# EAGLE design печатная плата (EAGLE 9.6.2)
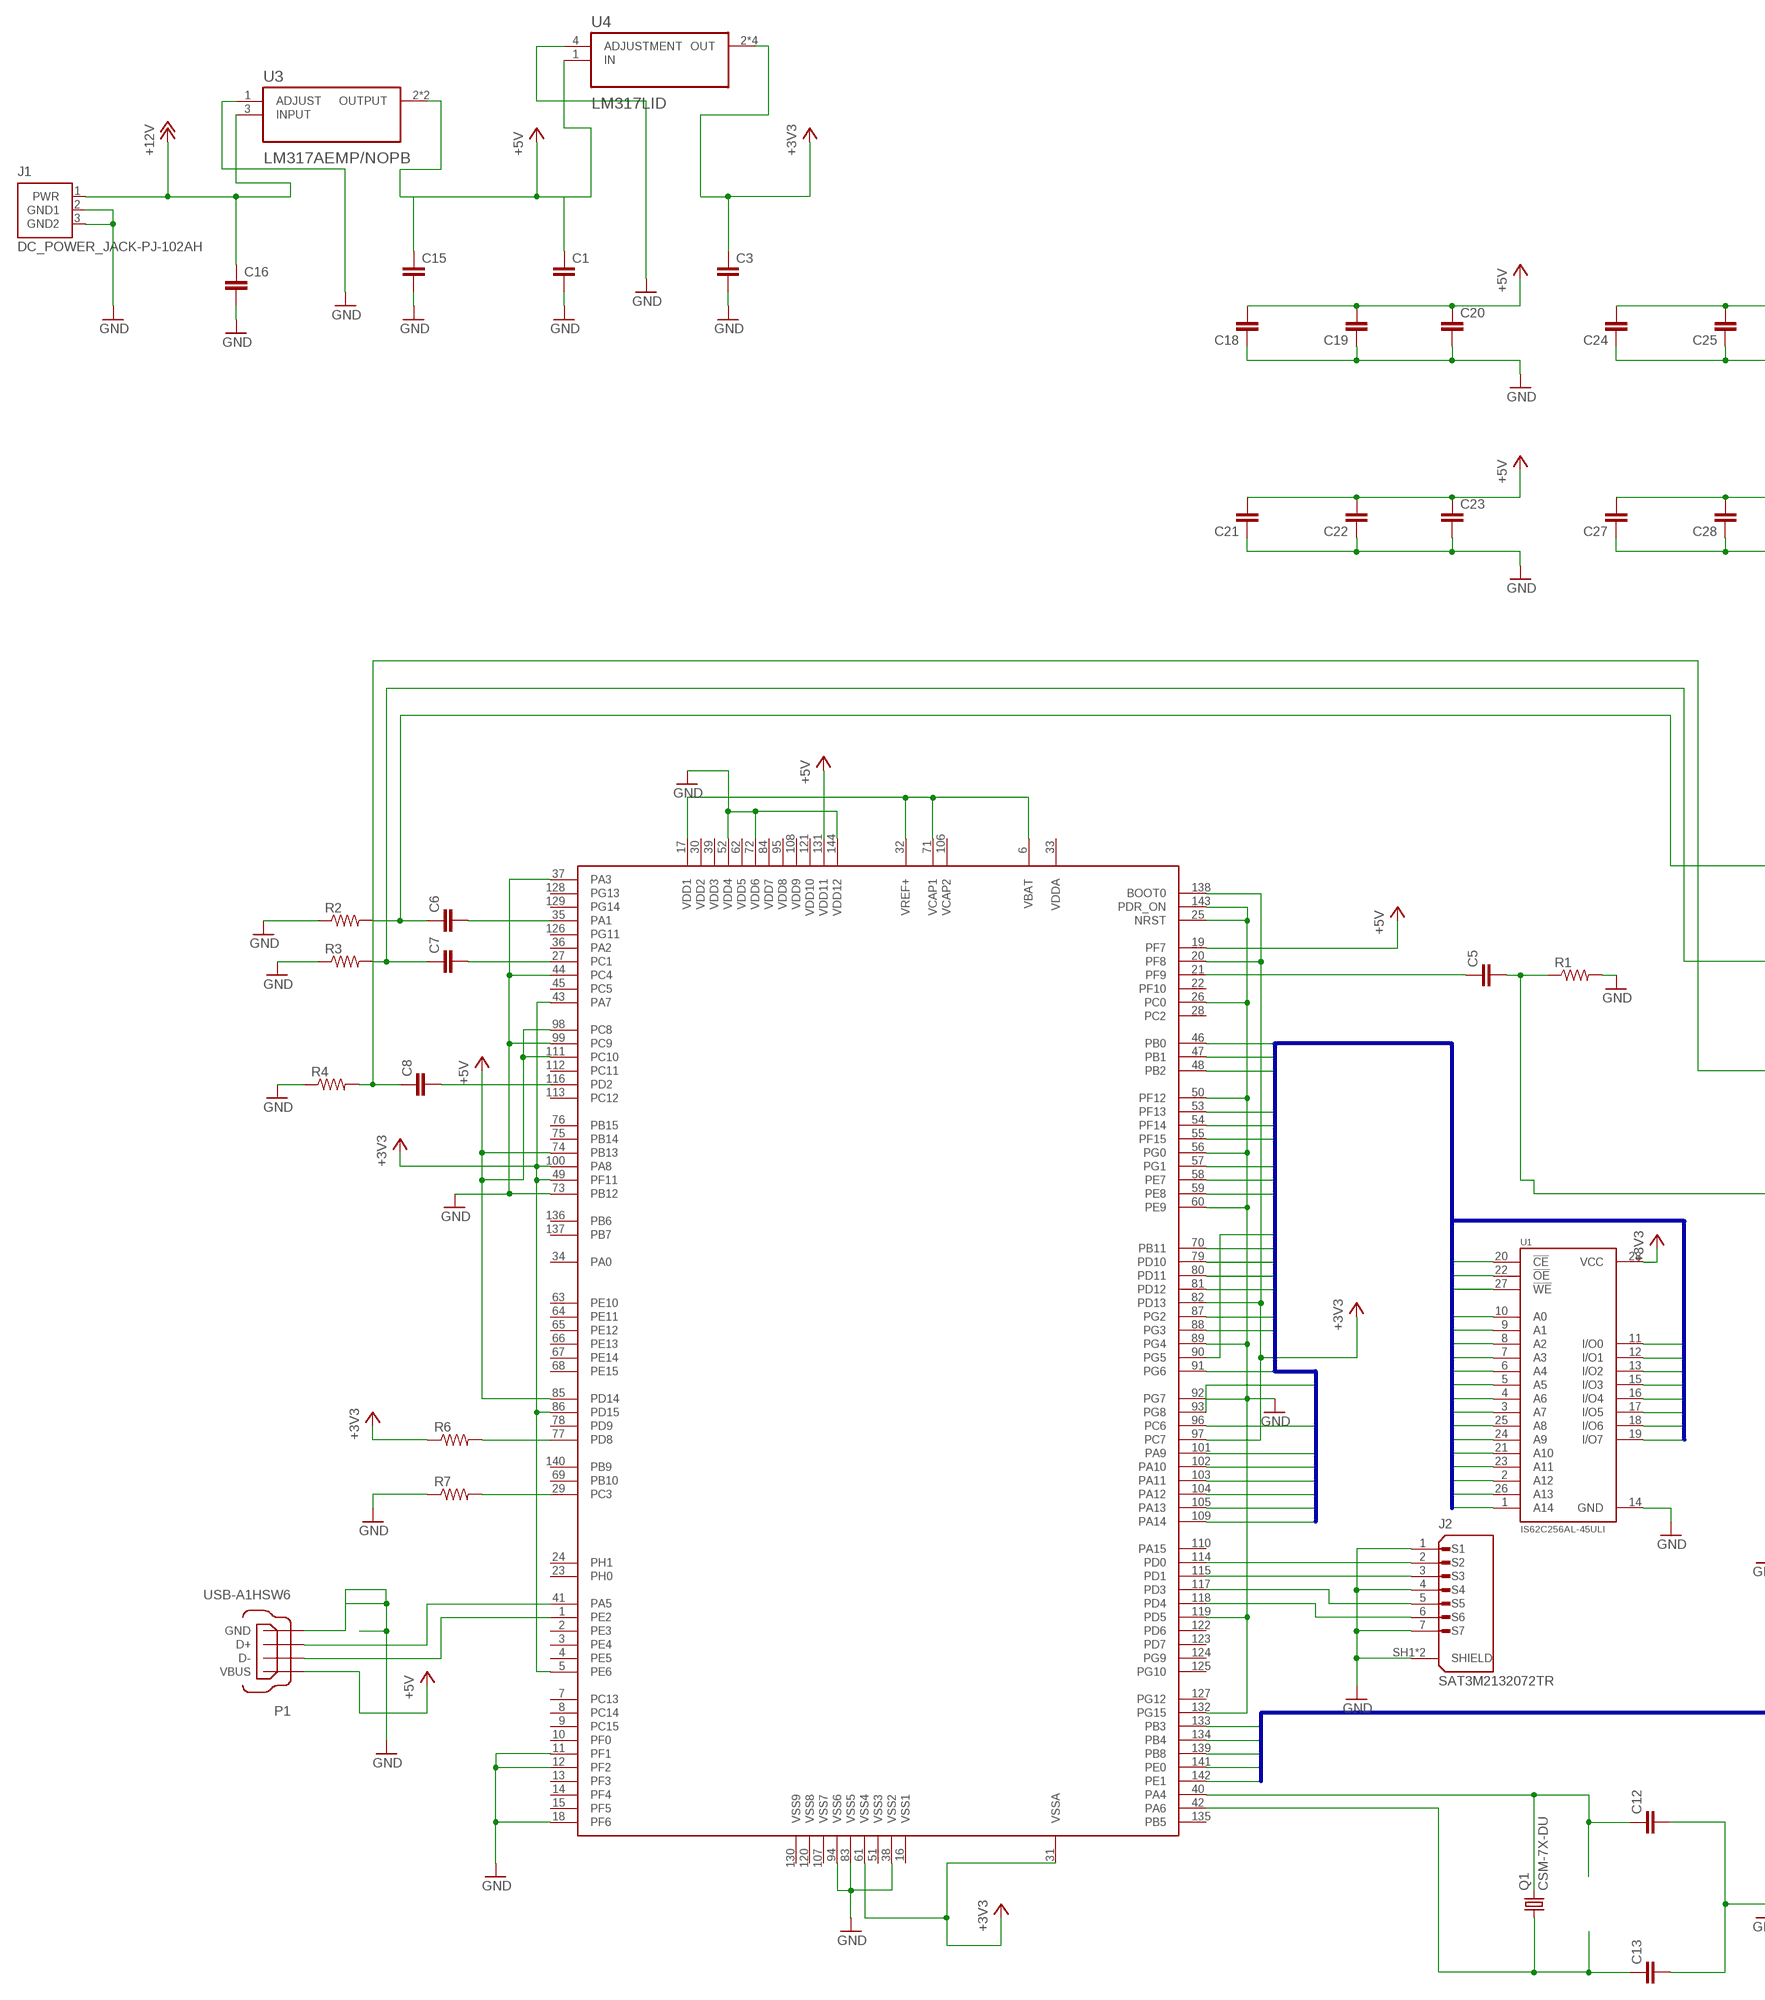
[diagram p0: schematic, sheet 1, part 1 of 2]
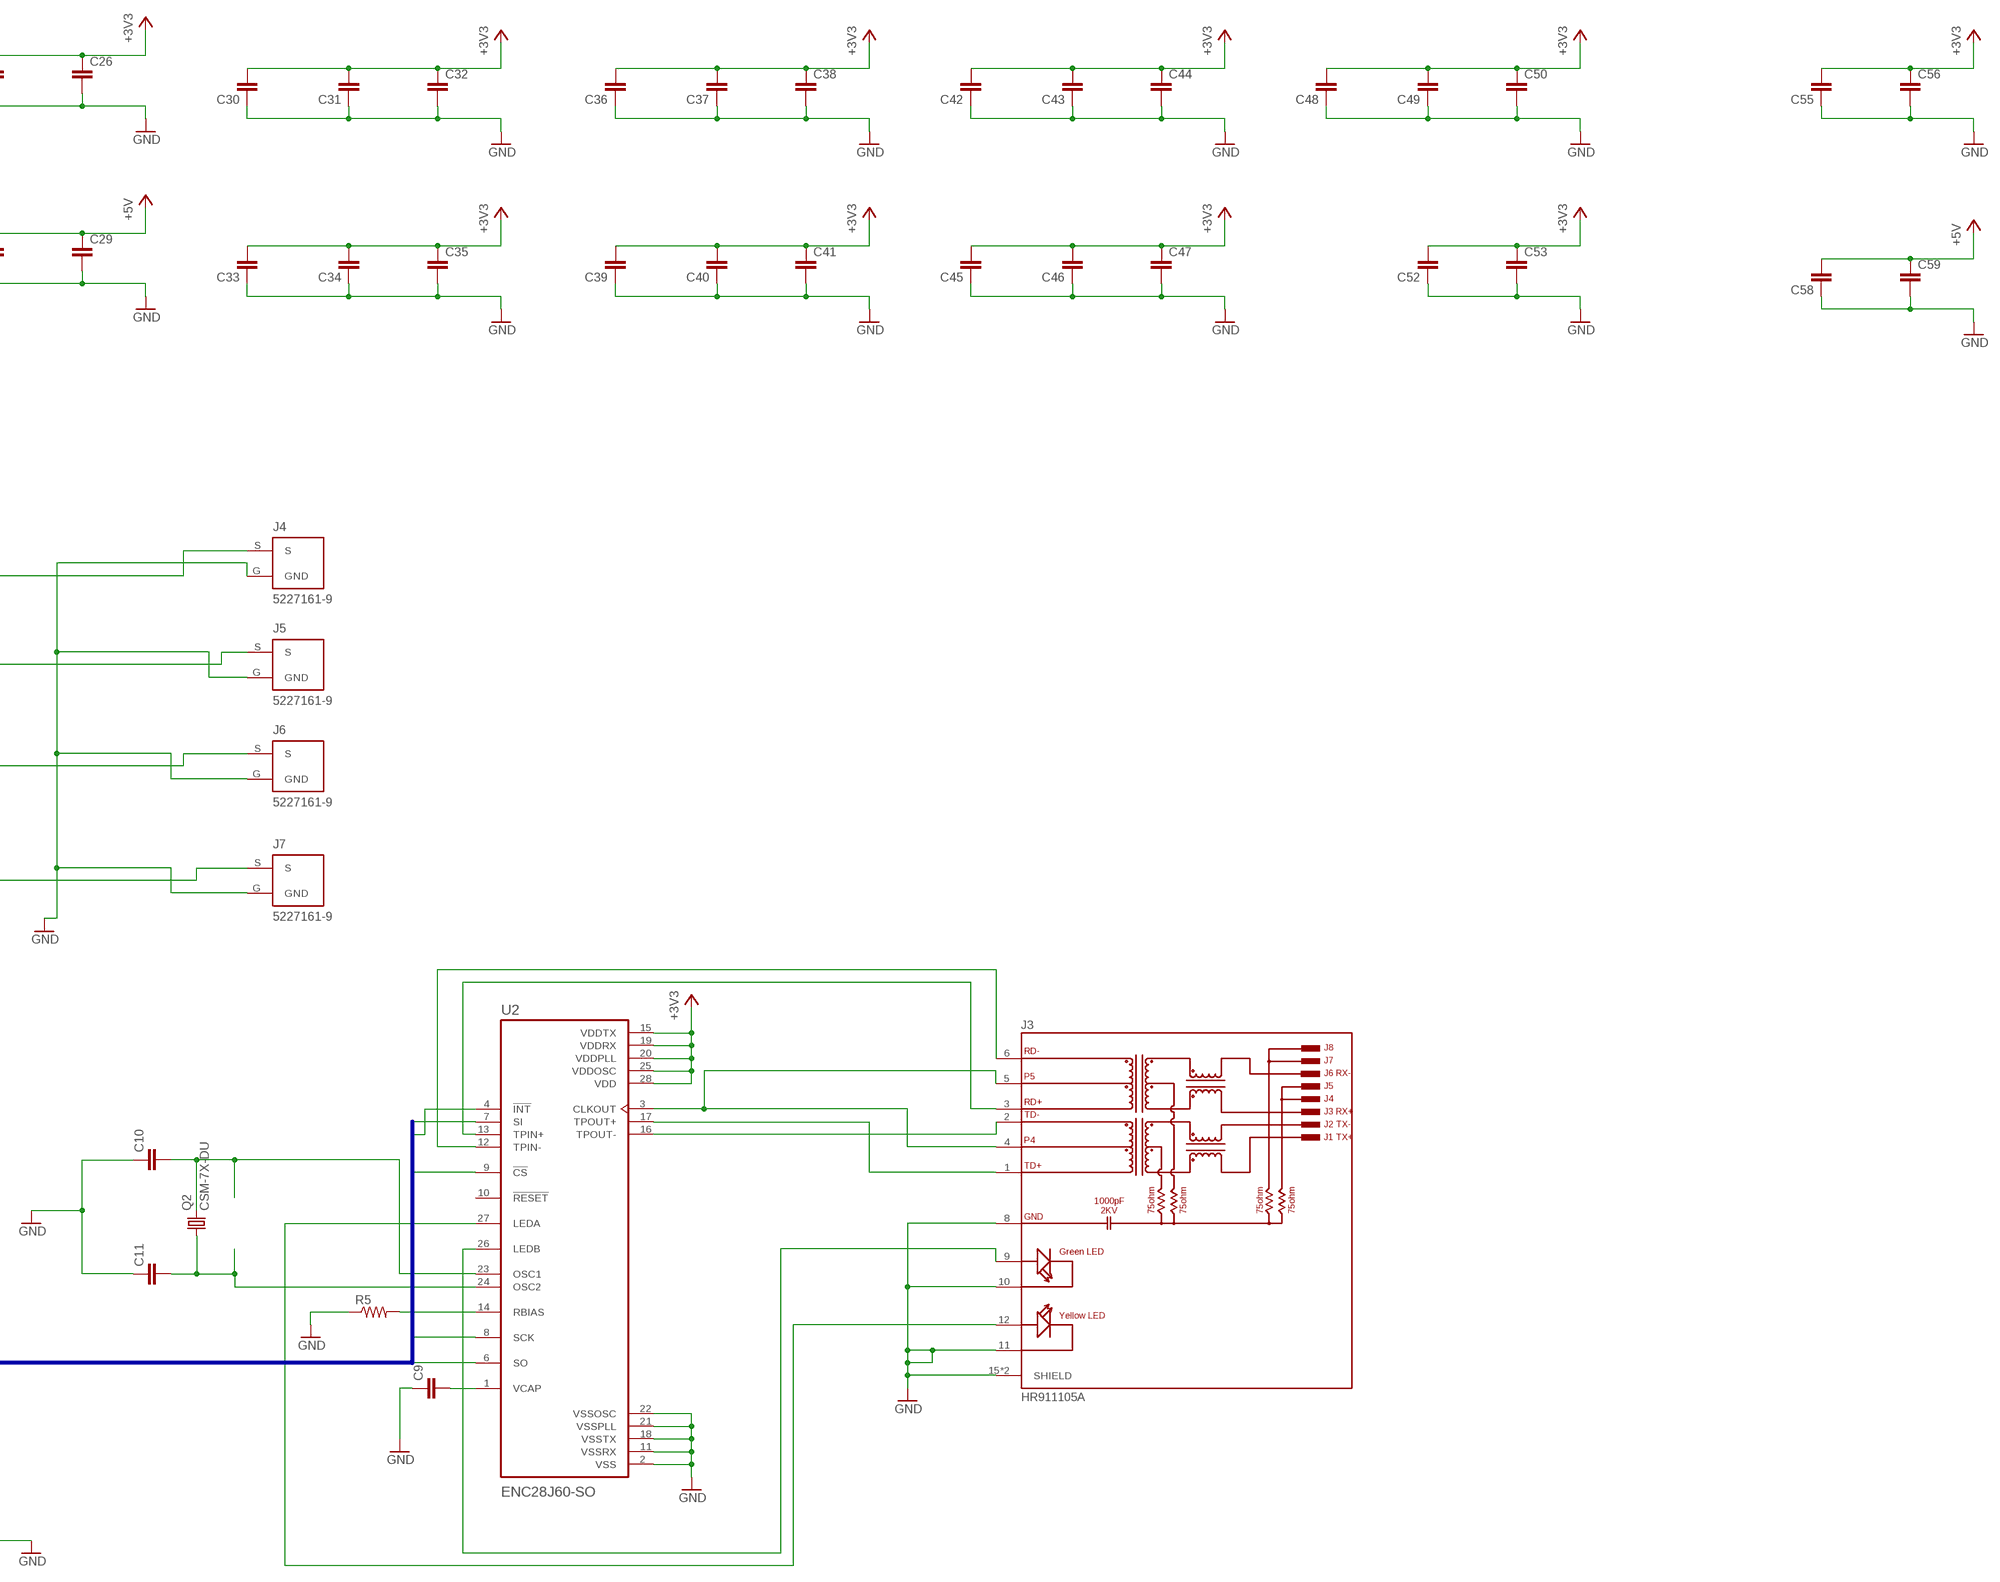
[diagram p1: schematic, sheet 1, part 2 of 2]

## Parts
C1  C_0201  [0201]
C3  C_0201  [0201]
C5  C_0201  [0201]
C6  C_0201  [0201]
C7  C_0201  [0201]
C8  C_0201  [0201]
C9  C_0201  [0201]
C10  C_0201  [0201]
C11  C_0201  [0201]
C12  C_0201  [0201]
C13  C_0201  [0201]
C15  C_0201  [0201]
C16  C_0201  [0201]
C18  C_0201  [0201]
C19  C_0201  [0201]
C20  C_0201  [0201]
C21  C_0201  [0201]
C22  C_0201  [0201]
C23  C_0201  [0201]
C24  C_0201  [0201]
C25  C_0201  [0201]
C26  C_0201  [0201]
C27  C_0201  [0201]
C28  C_0201  [0201]
C29  C_0201  [0201]
C30  C_0201  [0201]
C31  C_0201  [0201]
C32  C_0201  [0201]
C33  C_0201  [0201]
C34  C_0201  [0201]
C35  C_0201  [0201]
C36  C_0201  [0201]
C37  C_0201  [0201]
C38  C_0201  [0201]
C39  C_0201  [0201]
C40  C_0201  [0201]
C41  C_0201  [0201]
C42  C_0201  [0201]
C43  C_0201  [0201]
C44  C_0201  [0201]
C45  C_0201  [0201]
C46  C_0201  [0201]
C47  C_0201  [0201]
C48  C_0201  [0201]
C49  C_0201  [0201]
C50  C_0201  [0201]
C52  C_0201  [0201]
C53  C_0201  [0201]
C55  C_0201  [0201]
C56  C_0201  [0201]
C58  C_0201  [0201]
C59  C_0201  [0201]
J1  DC_POWER_JACK-PJ-102AH  [PJ-102AH]
J2  SAT3M2132072TR  [AMPHENOL_SAT3M2132072TR]
J3  HR911105A  [HANRUN_HR911105A]
J4  5227161-9  [TE_5227161-9]
J5  5227161-9  [TE_5227161-9]
J6  5227161-9  [TE_5227161-9]
J7  5227161-9  [TE_5227161-9]
P1  USB-A1HSW6  [OST_USB-A1HSW6]
Q1  CSM-7X-DU  [CSM-7X-DU]
Q2  CSM-7X-DU  [CSM-7X-DU]
R1  R-US_M1406  [M1406]
R2  R-US_M1406  [M1406]
R3  R-US_M1406  [M1406]
R4  R-US_M1406  [M1406]
R5  R-US_M1406  [M1406]
R6  R-US_M1406  [M1406]
R7  R-US_M1406  [M1406]
U1  IS62C256AL-45ULI  [SOIC127P1210X305-28N]
U2  ENC28J60-SO  [SOIC127P1030X265-28N]
U3  LM317AEMP/NOPB  [SOT230P700X180-4N]
U4  LM317LID  [SOIC127P599X175-8N]
U$1  STM32F4Z_144PIN  [LQFP144]

## Nets
+3V3 [supply]: C3.1 C24.2 C25.2 C26.1 C30.2 C31.2 C32.1 C33.2 C34.2 C35.1 C36.2 C37.2 C38.1 C39.2 C40.2 C41.1 C42.2 C43.2 C44.1 C45.2 C46.2 C47.1 C48.2 C49.2 C50.1 C52.2 C53.1 C55.2 C56.1 R6.1 U1.28(VCC) U2.15(VDDTX) U2.19(VDDRX) U2.20(VDDPLL) U2.25(VDDOSC) U2.28(VDD) U4.2(OUT) U4.3(OUT) U4.6(OUT) U4.7(OUT) U$1.5(PE6) U$1.20(PF8) U$1.31(VSSA) U$1.43(PA7) U$1.49(PF11) U$1.61(VSS4) U$1.82(PD13) U$1.86(PD15) U$1.97(PC7) U$1.100(PA8) U$1.138(BOOT0)
+5V [supply]: C1.1 C18.2 C19.2 C20.1 C21.2 C22.2 C23.1 C27.2 C28.2 C29.1 C58.2 C59.1 P1.1(VBUS) U3.2(OUTPUT) U3.4(OUTPUT) U4.1(IN) U$1.19(PF7) U$1.74(PB13) U$1.85(PD14) U$1.98(PC8) U$1.111(PC10) U$1.131(VDD11)
+5V1: C15.1
+12V [supply]: C16.1 J1.1(PWR) U3.3(INPUT)
A1: U2.6(SO) U$1.133(PB3)
A2: U2.8(SCK) U$1.134(PB4)
A3: U2.9(!CS) U$1.139(PB8)
A4: U2.7(SI) U$1.141(PE0)
A5: U2.4(!INT) U$1.142(PE1)
D0: U$1.46(PB0)
D1: U1.20(!CE)
D2: U1.22(!OE) U$1.47(PB1) U$1.48(PB2)
D3: U1.27(!WE) U$1.53(PF13)
D4: U1.10(A0) U$1.54(PF14)
D5: U1.9(A1) U$1.55(PF15)
D6: U1.8(A2) U$1.57(PG1)
D7: U1.7(A3) U$1.58(PE7)
D8: U1.6(A4) U$1.59(PE8)
D9: U1.5(A5) U$1.70(PB11)
D10: U1.4(A6) U$1.79(PD10)
D11: U1.3(A7) U$1.80(PD11)
D12: U1.25(A8) U$1.81(PD12)
D13: U1.24(A9) U$1.87(PG2)
D14: U1.21(A10) U$1.88(PG3)
D15: U1.23(A11)
D16: U1.2(A12) U$1.91(PG6)
D17: U1.26(A13) U$1.93(PG8)
D18: U1.1(A14) U$1.96(PC6)
D19: U1.11(I/O0) U$1.101(PA9)
D20: U1.12(I/O1)
D21: U1.13(I/O2) U$1.102(PA10)
D22: U1.15(I/O3) U$1.103(PA11)
D23: U1.16(I/O4) U$1.104(PA12)
D24: U1.17(I/O5) U$1.105(PA13)
D25: U1.18(I/O6) U$1.109(PA14)
D26: U1.19(I/O7) U$1.90(PG5)
GND [supply]: C1.2 C3.2 C9.1 C10.1 C11.1 C12.2 C13.2 C15.2 C16.2 C18.1 C19.1 C20.2 C21.1 C22.1 C23.2 C24.1 C25.1 C26.2 C27.1 C28.1 C29.2 C30.1 C31.1 C32.2 C33.1 C34.1 C35.2 C36.1 C37.1 C38.2 C39.1 C40.1 C41.2 C42.1 C43.1 C44.2 C45.1 C46.1 C47.2 C48.1 C49.1 C50.2 C52.1 C53.2 C55.1 C56.2 C58.1 C59.2 J1.2(GND1) J1.3(GND2) J2.1(S1) J2.4(S4) J2.7(S7) J2.SH1(SHIELD) J2.SH2(SHIELD) J3.8(GND) J3.10(GC) J3.11(YC) J3.15(SHIELD) J3.16(SHIELD) J4.G(GND) J5.G(GND) J6.G(GND) J7.G(GND) P1.4(GND) R1.2 R2.1 R3.1 R4.1 R5.1 R7.1 U1.14(GND) U2.2(VSS) U2.11(VSSRX) U2.18(VSSTX) U2.21(VSSPLL) U2.22(VSSOSC) U3.1(ADJUST) U4.4(ADJUSTMENT) U$1.11(PF1) U$1.12(PF2) U$1.18(PF6) U$1.25(NRST) U$1.26(PC0) U$1.37(PA3) U$1.38(VSS2) U$1.44(PC4) U$1.50(PF12) U$1.52(VDD4) U$1.56(PG0) U$1.60(PE9) U$1.72(VDD6) U$1.73(PB12) U$1.83(VSS5) U$1.89(PG4) U$1.92(PG7) U$1.94(VSS6) U$1.99(PC9) U$1.119(PD5) U$1.132(PG15) U$1.143(PDR_ON) U$1.144(VDD12)
N$1: C5.2 J7.S R1.1
N$2: U$1.6(VBAT) U$1.17(VDD1) U$1.32(VREF+) U$1.71(VCAP1)
N$3: C6.1 J4.S R2.2
N$4: C7.1 J5.S R3.2
N$5: C8.1 J6.S R4.2
N$6: J2.2(S2) U$1.114(PD0)
N$7: C6.2 U$1.35(PA1)
N$8: C7.2 U$1.27(PC1)
N$9: C8.2 U$1.116(PD2)
N$10: C5.1 U$1.21(PF9)
N$11: J2.3(S3) U$1.115(PD1)
N$12: J2.5(S5) U$1.117(PD3)
N$13: J2.6(S6) U$1.118(PD4)
N$14: J3.2(TD-) U2.16(TPOUT-)
N$15: J3.1(TD+) U2.17(TPOUT+)
N$16: J3.3(RD+) U2.13(TPIN+)
N$17: J3.6(RD-) U2.12(TPIN-)
N$18: C9.2 U2.1(VCAP)
N$19: C12.1 Q1.2 U$1.40(PA4)
N$20: C11.2 Q2.1 U2.24(OSC2)
N$21: C10.2 Q2.2 U2.23(OSC1)
N$22: C13.1 Q1.1 U$1.42(PA6)
N$23: R5.2 U2.14(RBIAS)
N$24: R7.2 U$1.29(PC3)
N$25: J3.4 J3.5 U2.3(CLKOUT)
N$26: R6.2 U$1.77(PD8)
N$27: P1.3(D+) U$1.41(PA5)
N$28: P1.2(D-) U$1.1(PE2)
N$29: J3.9(GA) U2.26(LEDB)
N$30: J3.12(YA) U2.27(LEDA)
Unconnected: U2.10(!RESET) U$1.2(PE3) U$1.3(PE4) U$1.4(PE5) U$1.7(PC13) U$1.8(PC14) U$1.9(PC15) U$1.10(PF0) U$1.13(PF3) U$1.14(PF4) U$1.15(PF5) U$1.16(VSS1) U$1.22(PF10) U$1.23(PH0) U$1.24(PH1) U$1.28(PC2) U$1.30(VDD2) U$1.33(VDDA) U$1.34(PA0) U$1.36(PA2) U$1.39(VDD3) U$1.45(PC5) U$1.51(VSS3) U$1.62(VDD5) U$1.63(PE10) U$1.64(PE11) U$1.65(PE12) U$1.66(PE13) U$1.67(PE14) U$1.68(PE15) U$1.69(PB10) U$1.75(PB14) U$1.76(PB15) U$1.78(PD9) U$1.84(VDD7) U$1.95(VDD8) U$1.106(VCAP2) U$1.107(VSS7) U$1.108(VDD9) U$1.110(PA15) U$1.112(PC11) U$1.113(PC12) U$1.120(VSS8) U$1.121(VDD10) U$1.122(PD6) U$1.123(PD7) U$1.124(PG9) U$1.125(PG10) U$1.126(PG11) U$1.127(PG12) U$1.128(PG13) U$1.129(PG14) U$1.130(VSS9) U$1.135(PB5) U$1.136(PB6) U$1.137(PB7) U$1.140(PB9)

## Buses
D[0..26]
A[0..6]

## Library data of the parts
C1 C3 C5-C13 C15 C16 C18-C50 C52 C53 C55 C56 C58 C59 = RHD2000_eval_board:C: Capacitor
J1 = connectors:DC_POWER_JACK: DC Power Jack
J2 = SAT3M2132072TR:SAT3M2132072TR: Check availability <https://pricing.snapeda.com/parts/SAT3M2132072TR/AMPHENOL%20ICC%20/%20FCI/view-part?ref=eda>; AVAILABILITY: In Stock; DESCRIPTION: Sata,Storage and server connector,1.27mm pitch,Right angle,surface mount,1.5A current,Tape and Reel.; MF: AMPHENOL ICC / FCI; MP: SAT3M2132072TR; PACKAGE: None; PRICE: None; PURCHASE-URL: https://pricing.snapeda.com/search/part/SAT3M2132072TR/?ref=eda
J3 = HR911105A:HR911105A: DIP RJ45 Connector; Check availability <https://pricing.snapeda.com/parts/HR911105A/hanrun/view-part?ref=eda>; AVAILABILITY: Not in stock; MF: hanrun; MP: HR911105A; PACKAGE: None; PRICE: None
J4-J7 = 5227161-9:5227161-9: Jack, PCB; 50 Ohms; Right Angle; BNC; Gold (30); Panel; Jack; Valox; Phosphor Bronze Check availability <https://pricing.snapeda.com/parts/5227161-9/TE%20Connectivity/view-part?ref=eda>; AVAILABILITY: In Stock; COMMENT: 5227161-9; DESCRIPTION: RTANG JACK W/MTG PINS,BNC PCB; EU_ROHS_COMPLIANCE: Compliant with Exemptions; MF: TE Connectivity; MP: 5227161-9; NUMBER_OF_POSITIONS: 1; PACKAGE: None; PRICE: None; PURCHASE-URL: https://pricing.snapeda.com/search/part/5227161-9/?ref=eda
P1 = USB-A1HSW6:USB-A1HSW6: USB - A Receptacle Connector 4 Position Through Hole, Right Angle Check availability <https://pricing.snapeda.com/parts/USB-A1HSW6/On%20Shore/view-part?ref=eda>; AVAILABILITY: In Stock; DESCRIPTION: USB-A (USB TYPE-A) - Receptacle Connector 4 Position Through Hole, Right Angle; MF: On Shore; MP: USB-A1HSW6; PACKAGE: None; PRICE: None; PURCHASE-URL: https://pricing.snapeda.com/search/part/USB-A1HSW6/?ref=eda
Q1 Q2 = crystal:CSM-7X-DU: SMD CRYSTAL Source: www.ecsxtal.com .. Crystal 3.6864MHz CSM_7X_DU.PDF; OC_FARNELL: unknown; OC_NEWARK: unknown
R1-R7 = adafruit:R-US_: RESISTOR, American symbol
U1 = IS62C256AL-45ULI:IS62C256AL-45ULI: SRAM Chip Asynchronous Single 5 Volt 256k-Bit 32k X 8 45ns 28-Pin Sop Check availability <https://pricing.snapeda.com/parts/IS62C256AL-45ULI/ISSI/view-part?ref=eda>; AVAILABILITY: In Stock; DESCRIPTION: SRAM - Asynchronous Memory IC 256Kb (32K x 8) Parallel 45 ns 28-SOP; MF: ISSI; MP: IS62C256AL-45ULI; PACKAGE: SOP-28 ISSI; PRICE: None; PURCHASE-URL: https://pricing.snapeda.com/search/part/IS62C256AL-45ULI/?ref=eda
U2 = ENC28J60:ENC28J60: Check availability <https://pricing.snapeda.com/parts/ENC28J60/Microchip/view-part?ref=eda>; AVAILABILITY: In Stock; DESCRIPTION: Ethernet Controller 10 Base-T PHY SPI Interface 28-QFN (6x6); MF: Microchip; MP: ENC28J60; PACKAGE: SSOP Microchip; PRICE: None; PURCHASE-URL: https://pricing.snapeda.com/search/part/ENC28J60/?ref=eda
U3 = LM317AEMP_NOPB:LM317AEMP/NOPB: Check availability <https://pricing.snapeda.com/parts/LM317AEMP/Texas%20Instruments/view-part?ref=eda>; AVAILABILITY: In Stock; DESCRIPTION: 1.5-A, 40-V, adjustable linear voltage regulator with high-accuracy 4-SOT-223 -40 to 125; MF: Texas Instruments; MP: LM317AEMP; PACKAGE: SOT-223-4 Texas Instruments; PRICE: None; PURCHASE-URL: https://pricing.snapeda.com/search/part/LM317AEMP/?ref=eda
U4 = LM317LID:LM317LID: Check availability <https://pricing.snapeda.com/parts/LM317LID/Texas%20Instruments/view-part?ref=eda>; AVAILABILITY: In Stock; DESCRIPTION: 100-mA, 35-V, adjustable linear voltage regulator; MF: Texas Instruments; MP: LM317LID; PACKAGE: SOIC-8 Texas Instruments; PRICE: None; PURCHASE-URL: https://pricing.snapeda.com/search/part/LM317LID/?ref=eda
U$1 = stm32f4:STM32F4Z_144PIN: STM32F4XX LQFP packages with actual and functional symbols.

## Net classes
0 default: width 0.152 mm
1 supply: width 0.406 mm

## Board
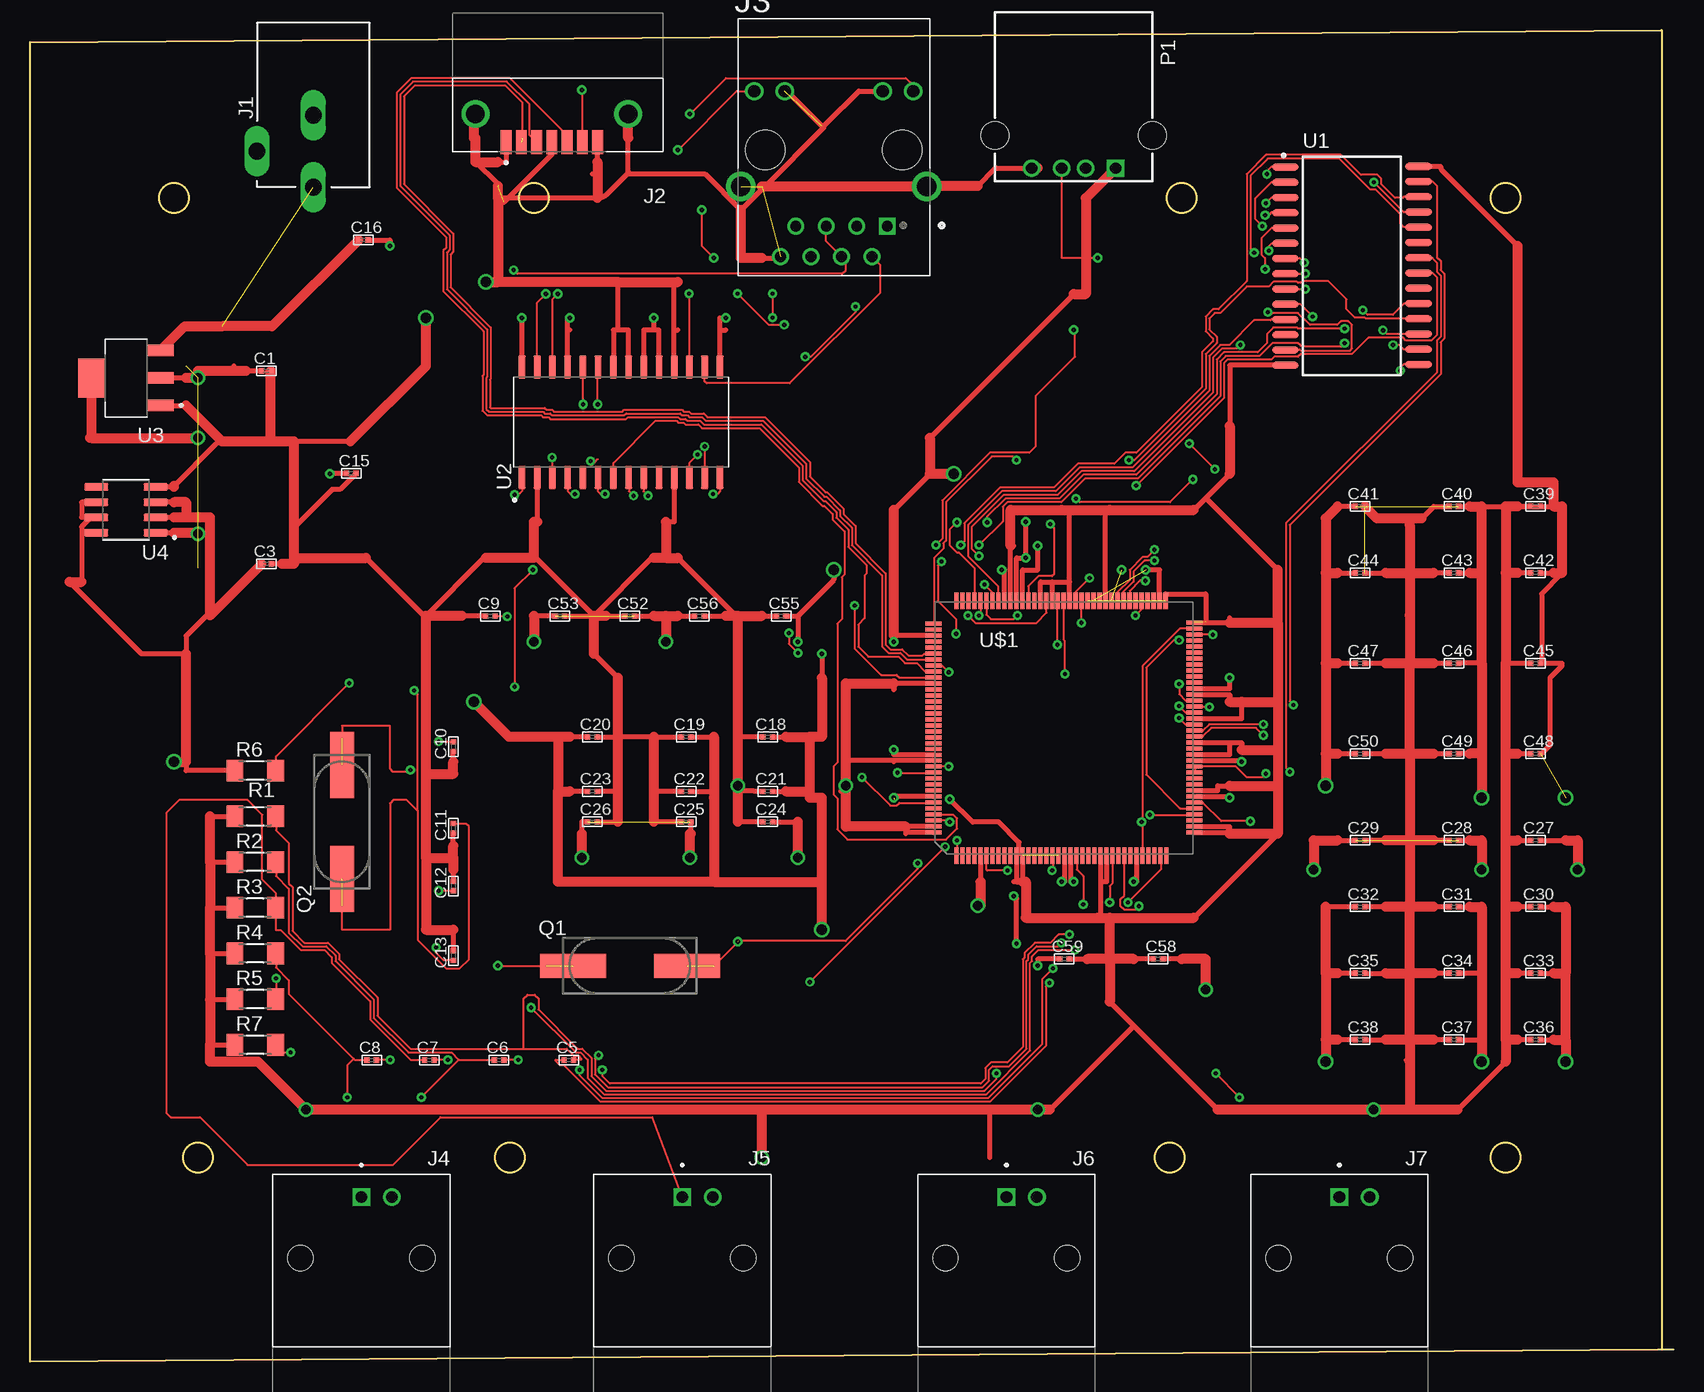
[diagram p2: board, top side]
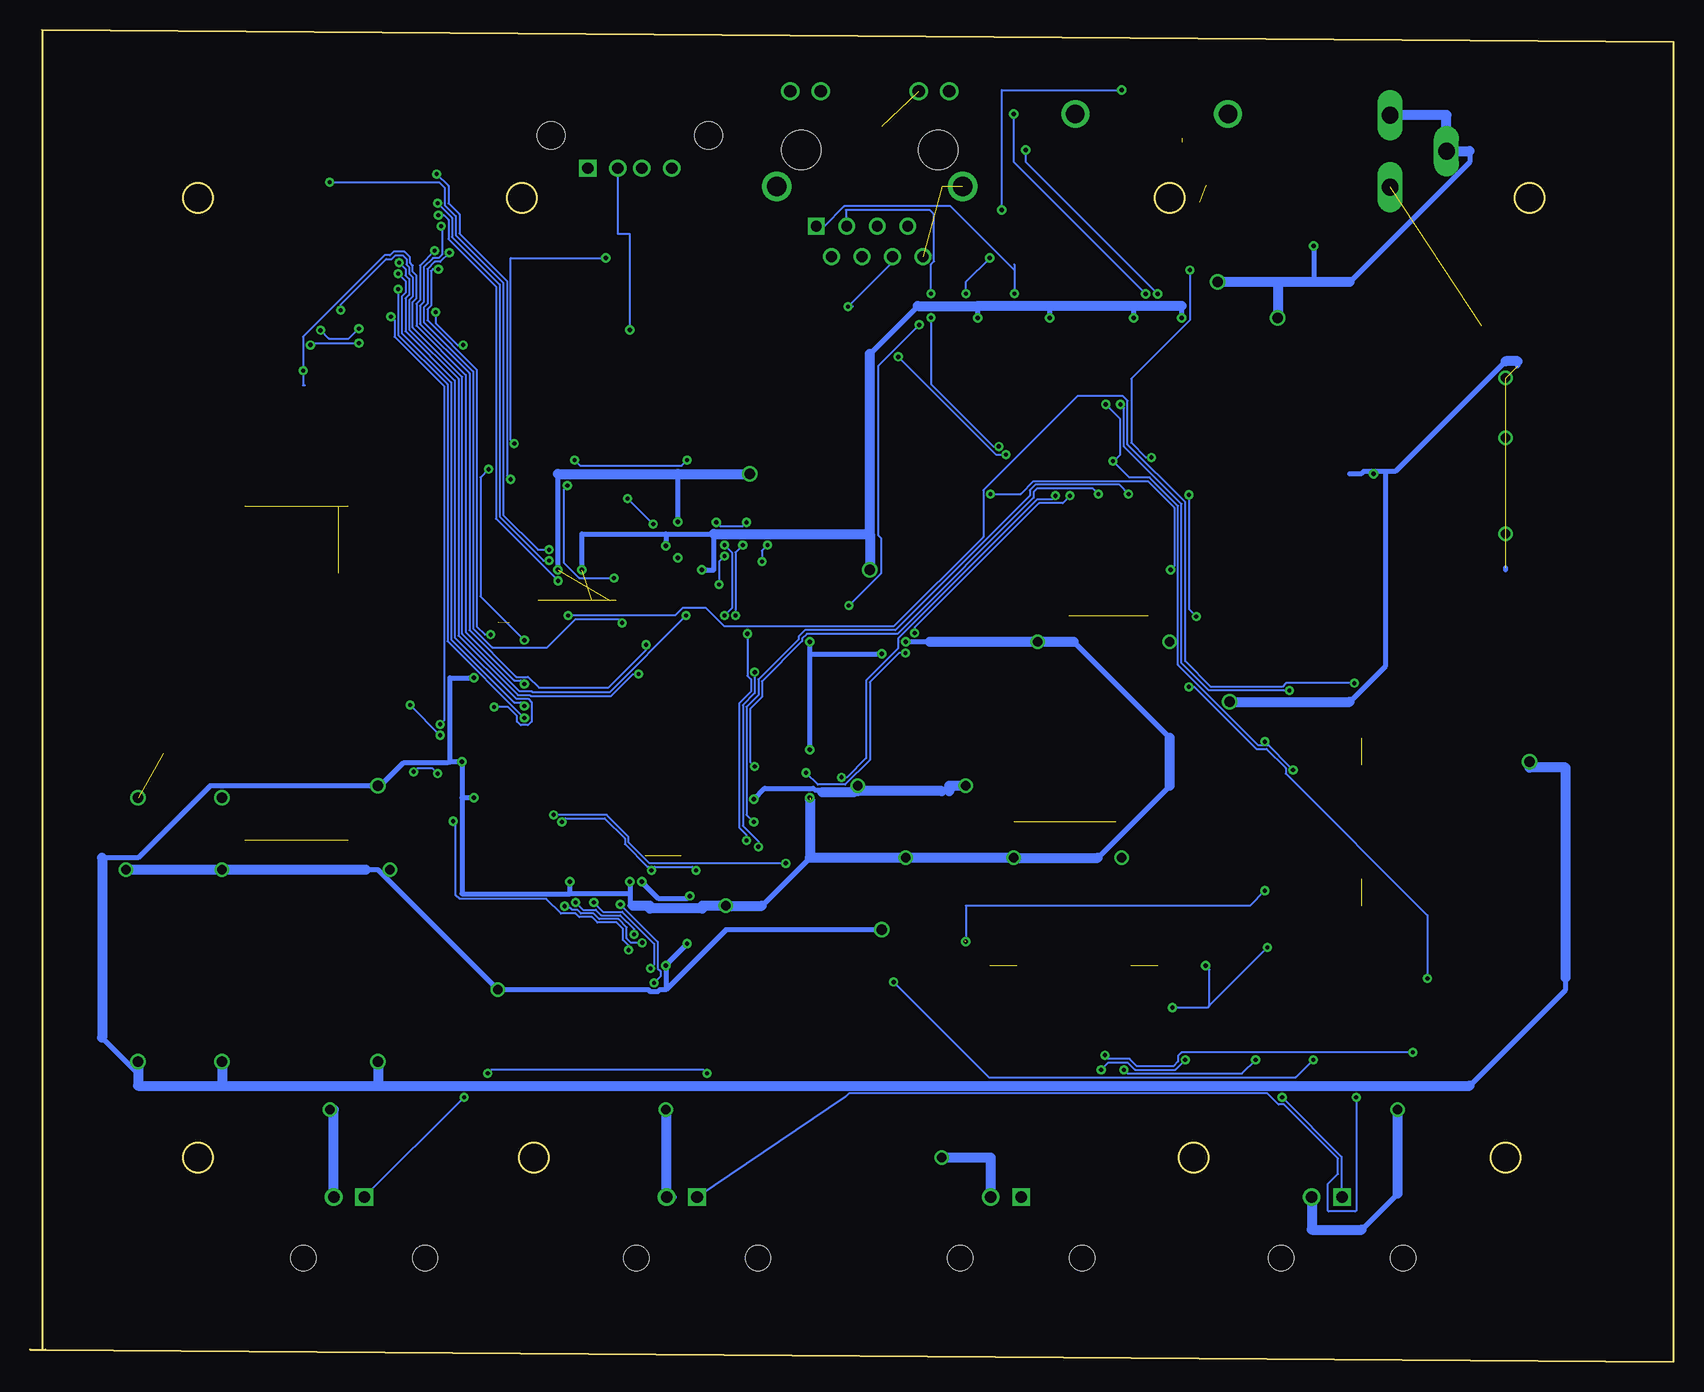
[diagram p3: board, bottom side, seen from below]

Size 137 x 111 mm. Coordinates in mm from the lower left corner, seen from the top.
Outline: 137,1 136,1
Outline: 136,1 135.7,1 0,0 0,110 136,111 136,1
Outline: circle at 96,97 radius 1.25
Outline: circle at 42,97 radius 1.25
Outline: circle at 123,17 radius 1.25
Outline: circle at 95,17 radius 1.25
Outline: circle at 14,17 radius 1.25
Outline: circle at 40,17 radius 1.25
Outline: circle at 123,97 radius 1.25
Outline: circle at 12,97 radius 1.25
Copper layers (1*16): Top 0.035mm / dielectric 1.5mm / Bottom 0.035mm
Design rules "default": minimum track width 6mil, minimum drill 0.35mm, track to track 6mil, track to pad 6mil, pad to pad 6mil, via to via 6mil, smd to smd 6mil, copper to edge 40mil, drill to drill 6mil, minimum pad ring 10mil, minimum via ring 8mil, stop-mask expansion 4mil, vias tented up to drill 0mil, thermal gap 10mil

### Footprints (pad centres in the part's own frame; a part is rotated, then mirrored left to right if it is on the bottom)
0201 = smd 0.432 x 0.432: 1 -0.394,0; 2 0.394,0
PJ-102AH = drill 1.4 long: 1 0,-3; 2 0,3; 3 -4.7,0
AMPHENOL_SAT3M2132072TR = smd 0.9 x 2: 1 4.31,2.36; 2 3.04,2.36; 3 1.77,2.36; 4 0.5,2.36; 5 -0.77,2.36; 6 -2.04,2.36; 7 -3.31,2.36 | drill 1.55: SH1 -5.87,0; SH2 6.87,0
HANRUN_HR911105A = drill 0.89 square: 1 4.45,-6.35 | drill 0.89: 2 3.18,-8.89; 3 1.91,-6.35; 4 0.64,-8.89; 5 -0.63,-6.35; 6 -1.9,-8.89; 7 -3.17,-6.35; 8 -4.44,-8.89 | drill 1.02: 9 6.625,4.9; 10 4.085,4.9; 11 -4.085,4.9; 12 -6.625,4.9 | drill 1.63: 15 7.745,-3.05; 16 -7.745,-3.05 | hole 3.25: -5.715,0; 5.715,0
TE_5227161-9 = drill 0.97: G -2.54,-5.08 | drill 0.97 square: S 0,-5.08 | hole 2.09: 5.08,0; -5.08,0
OST_USB-A1HSW6 = drill 0.92 square: 1 -3.5,6.51 | drill 0.92: 2 -1,6.51; 3 1,6.51; 4 3.5,6.51 | hole 2.3: -6.57,3.8; 6.57,3.8
CSM-7X-DU = smd 5.5 x 2: 1 -4.75,0; 2 4.75,0
M1406 = smd 1.4 x 1.8: 1 -1.7,0; 2 1.7,0
SOIC127P1210X305-28N = smd 2.25 x 0.6: 1 -5.55,8.225; 2 -5.55,6.955; 3 -5.55,5.685; 4 -5.55,4.415; 5 -5.55,3.145; 6 -5.55,1.875; 7 -5.55,0.605; 8 -5.55,-0.665; 9 -5.55,-1.935; 10 -5.55,-3.205; 11 -5.55,-4.475; 12 -5.55,-5.745; 13 -5.55,-7.015; 14 -5.55,-8.285; 15 5.55,-8.225; 16 5.55,-6.955; 17 5.55,-5.685; 18 5.55,-4.415; 19 5.55,-3.145; 20 5.55,-1.875; 21 5.55,-0.605; 22 5.55,0.665; 23 5.55,1.935; 24 5.55,3.205; 25 5.55,4.475; 26 5.55,5.745; 27 5.55,7.015; 28 5.55,8.285
SOIC127P1030X265-28N = smd 1.9 x 0.6: 1 -4.605,8.255; 2 -4.605,6.985; 3 -4.605,5.715; 4 -4.605,4.445; 5 -4.605,3.175; 6 -4.605,1.905; 7 -4.605,0.635; 8 -4.605,-0.635; 9 -4.605,-1.905; 10 -4.605,-3.175; 11 -4.605,-4.445; 12 -4.605,-5.715; 13 -4.605,-6.985; 14 -4.605,-8.255; 15 4.605,-8.255; 16 4.605,-6.985; 17 4.605,-5.715; 18 4.605,-4.445; 19 4.605,-3.175; 20 4.605,-1.905; 21 4.605,-0.635; 22 4.605,0.635; 23 4.605,1.905; 24 4.605,3.175; 25 4.605,4.445; 26 4.605,5.715; 27 4.605,6.985; 28 4.605,8.255
SOT230P700X180-4N = smd 2.15 x 0.95: 1 -2.9,2.3; 2 -2.9,0; 3 -2.9,-2.3 | smd 2.15 x 3.25: 4 2.9,0
SOIC127P599X175-8N = smd 1.97 x 0.6: 1 -2.47,1.905; 2 -2.47,0.635; 3 -2.47,-0.635; 4 -2.47,-1.905; 5 2.47,-1.905; 6 2.47,-0.635; 7 2.47,0.635; 8 2.47,1.905
LQFP144 = smd 0.35 x 1.35: 1 -9.2,-10.625; 2 -8.7,-10.625; 3 -8.2,-10.625; 4 -7.7,-10.625; 5 -7.2,-10.625; 6 -6.7,-10.625; 7 -6.2,-10.625; 8 -5.7,-10.625; 9 -5.2,-10.625; 10 -4.7,-10.625; 11 -4.2,-10.625; 12 -3.7,-10.625; 13 -3.2,-10.625; 14 -2.7,-10.625; 15 -2.2,-10.625; 16 -1.7,-10.625; 17 -1.2,-10.625; 18 -0.7,-10.625; 19 -0.2,-10.625; 20 0.3,-10.625; 21 0.8,-10.625; 22 1.3,-10.625; 23 1.8,-10.625; 24 2.3,-10.625; 25 2.8,-10.625; 26 3.3,-10.625; 27 3.8,-10.625; 28 4.3,-10.625; 29 4.8,-10.625; 30 5.3,-10.625; 31 5.8,-10.625; 32 6.3,-10.625; 33 6.8,-10.625; 34 7.3,-10.625; 35 7.8,-10.625; 36 8.3,-10.625; 73 8.225,10.625; 74 7.725,10.625; 75 7.225,10.625; 76 6.725,10.625; 77 6.225,10.625; 78 5.725,10.625; 79 5.225,10.625; 80 4.725,10.625; 81 4.225,10.625; 82 3.725,10.625; 83 3.225,10.625; 84 2.725,10.625; 85 2.225,10.625; 86 1.725,10.625; 87 1.225,10.625; 88 0.725,10.625; 89 0.225,10.625; 90 -0.275,10.625; 91 -0.775,10.625; 92 -1.225,10.625; 93 -1.725,10.625; 94 -2.2,10.625; 95 -2.7,10.625; 96 -3.2,10.625; 97 -3.7,10.625; 98 -4.2,10.625; 99 -4.7,10.625; 100 -5.2,10.625; 101 -5.7,10.625; 102 -6.2,10.625; 103 -6.7,10.625; 104 -7.2,10.625; 105 -7.7,10.625; 106 -8.2,10.625; 107 -8.7,10.625; 108 -9.2,10.625 | smd 1.35 x 0.35: 37 10.625,-8.7; 38 10.625,-8.2; 39 10.625,-7.7; 40 10.625,-7.2; 41 10.625,-6.7; 42 10.625,-6.2; 43 10.625,-5.7; 44 10.625,-5.2; 45 10.625,-4.7; 46 10.625,-4.2; 47 10.625,-3.7; 48 10.625,-3.2; 49 10.625,-2.7; 50 10.625,-2.2; 51 10.625,-1.7; 52 10.625,-1.2; 53 10.625,-0.7; 54 10.625,-0.2; 55 10.625,0.3; 56 10.625,0.8; 57 10.625,1.3; 58 10.625,1.8; 59 10.625,2.3; 60 10.625,2.8; 61 10.625,3.3; 62 10.625,3.8; 63 10.625,4.3; 64 10.625,4.8; 65 10.625,5.3; 66 10.625,5.8; 67 10.625,6.3; 68 10.625,6.8; 69 10.625,7.3; 70 10.625,7.8; 71 10.625,8.3; 72 10.625,8.8; 109 -11.125,8.725; 110 -11.125,8.225; 111 -11.125,7.725; 112 -11.125,7.225; 113 -11.125,6.725; 114 -11.125,6.225; 115 -11.125,5.725; 116 -11.125,5.225; 117 -11.125,4.725; 118 -11.125,4.225; 119 -11.125,3.725; 120 -11.125,3.225; 121 -11.125,2.725; 122 -11.125,2.225; 123 -11.125,1.725; 124 -11.125,1.225; 125 -11.125,0.725; 126 -11.125,0.225; 127 -11.125,-0.275; 128 -11.125,-0.775; 129 -11.125,-1.275; 130 -11.125,-1.725; 131 -11.125,-2.225; 132 -11.125,-2.7; 133 -11.125,-3.2; 134 -11.125,-3.7; 135 -11.125,-4.2; 136 -11.125,-4.7; 137 -11.125,-5.2; 138 -11.125,-5.7; 139 -11.125,-6.2; 140 -11.125,-6.7; 141 -11.125,-7.2; 142 -11.125,-7.7; 143 -11.125,-8.2; 144 -11.125,-8.7

### Placement (x,y rotation side)
C1  19.7,82.58 0 top
C3  19.7,66.5 0 top
C5  44.91,25.13 0 top
C6  39.1,25.13 0 top
C7  33.29,25.13 0 top
C8  28.48,25.13 0 top
C9  38.37,62.15 0 top
C10  35.29,51.26 90 top
C11  35.29,44.45 90 top
C12  35.29,39.64 90 top
C13  35.29,33.83 90 top
C15  26.78,74.04 0 top
C16  27.78,93.5 0 top
C18  61.5,52.07 0 top
C19  54.69,52.07 0 top
C20  46.88,52.07 0 top
C21  61.5,47.53 0 top
C22  54.69,47.53 0 top
C23  46.88,47.53 0 top
C24  61.5,44.99 0 top
C25  54.69,44.99 0 top
C26  46.88,44.99 0 top
C27  125.5,43.45 0 top
C28  118.69,43.45 0 top
C29  110.88,43.45 0 top
C30  125.5,37.91 0 top
C31  118.69,37.91 0 top
C32  110.88,37.91 0 top
C33  125.5,32.37 0 top
C34  118.69,32.37 0 top
C35  110.88,32.37 0 top
C36  125.5,26.83 0 top
C37  118.69,26.83 0 top
C38  110.88,26.83 0 top
C39  125.5,71.29 0 top
C40  118.69,71.29 0 top
C41  110.88,71.29 0 top
C42  125.5,65.75 0 top
C43  118.69,65.75 0 top
C44  110.88,65.75 0 top
C45  125.5,58.21 0 top
C46  118.69,58.21 0 top
C47  110.88,58.21 0 top
C48  125.5,50.67 0 top
C49  118.69,50.67 0 top
C50  110.88,50.67 0 top
C52  49.99,62.15 0 top
C53  44.18,62.15 0 top
C55  62.61,62.15 0 top
C56  55.8,62.15 0 top
C58  94.03,33.56 0 top
C59  86.22,33.56 0 top
J1  23.62,100.9 0 top
J2  44,104 180 top
J3  67,101 0 top
J4  27.62,8.62 180 top
J5  54.37,8.62 180 top
J6  81.39,8.62 180 top
J7  109.14,8.62 180 top
P1  87,106 180 top
Q1  50,33 0 top
Q2  26,45 90 top
R1  18.78,45.45 180 top
R2  18.78,41.64 0 top
R3  18.78,37.83 0 top
R4  18.78,34.02 0 top
R5  18.78,30.21 0 top
R6  18.78,49.26 0 top
R7  18.78,26.4 0 top
U1  110.19,91.34 0 top
U2  49.26,78.31 90 top
U3  8,82 180 top
U4  8,71 180 top
U$1  86.44,52.8 0 top

### Tracks (layer width: path | path; a pad name or v marks a point on that pad's centre or on a via)
+3V3  (via drill 0.35, 0.8, 0.85)  (7 unrouted)
  Top 0.406: U1.28 117.59,99.62 arc45 117.73,99.27 124,93 | U$1.5 79.24,40 79,40 | U$1.31 92.24,40 v92,40 | U$1.20 86.74,40 v87,40 | U$1.61 100,56.1 v100,57 | U$1.138 72,47.1 v72,47 | v84,68 84,66 82.74,66 U$1.97 | U2.28 v41,87 | U2.20 51.16,86 52,86 | U2.19 52.44,86 52,86 | U2.15 57.52,86 | 57.52,86 58,86 | C40.2 120,71.29 C39.2 127,71.29 | C43.2 120,65.75 | 121,58.21 C46.2 | 120,50.67 C49.2 | C37.2 121,26.83 | 121,32.37 C34.2 | C31.2 120,37.91 | C36.2 127,26.83 | C33.2 127,32.37 | C30.2 127,37.91 | C48.2 126,50.67 126.7,51.38 126.7,57 127.7,58 127.7,58.21 C45.2 126,58.32 126,64 127.7,65.7 127.7,65.75 | C42.2 127,65.75 | C41.1 109,71.29 | 109,65.75 C44.1 | 108,65.75 108,66 | C38.1 109,26.83 | 108,26.83 108,27 | C35.1 109,32.37 | 108,32.37 108,32 | C32.1 108,37.91 108,38 | 109,50.67 C50.1 | 108,50.67 108,51 | 109,58.21 C47.1 | 108,58.21 108,58 | U$1.43 100,47.1 v100,47 | U$1.49 101,50.1 v101,50 | C52.2 52,62.15 53,62.15 54,62.15 C56.1 | C24.2 64,44.99 64,45 | R6.1 13,49.26 13,50 | C26.1 46,44.99 46,44 | 55,44.99 C25.2 55.08,44 | C53.1 42,62.15 | C55.2 64,62.15 | 64,62.15 v64,60 | 52,86 v52,87 | 57.52,86 57.52,87 v58,87 | U2.25 44.81,86 | 45,86 44.81,86 | 44.81,86 44.81,87 v45,87 | U$1.100 81.24,66 v81,66 | U4.6 4.29,71.64 4.29,70.36 U4.7 5.06,70.36 4.29,69.6 4.29,65 | 12,71.64 U4.3 | 12,70.36 U4.2 | 3.29,65 9.29,59 13,59 13,60.5 15,62.5 | 64,62.15 67,65.15 arc45 v67,66
  Top 0.813: 17.08,49.31 R6.1 | 109,71.29 108,70.29 108,65.75 | 108,65.75 108,58.21 | 128,26.83 128,32.37 | 128,32.37 128,37.91 127,37.91 | 108,32.37 108,26.83 | 108,32.37 108,37.91 | 108,58.21 108,50.67 | 121,50.67 121,58.21 121,65.75 | 121,65.75 121,71.29 120,71.29 | 108,50.67 v108,48 | 121,50.67 v121,47 | 108,26.83 v108,25 | v121,25 121,26.83 121,32.37 121,37.91 120,37.91 | 128,26.83 v128,25 | v12,50 13,50 13,59 | 3.29,65 4.29,65 | C3.1 15,62.19 15,62.5 15,70.36 13,70.36 | 13,70.36 13,71.64 12,71.64 | 13,70.36 12,70.36 | 109,26.83 108,26.83 | 109,32.37 108,32.37 | 127,26.83 128,26.83 | 127,32.37 128,32.37 | 120,65.75 121,65.75 | 127,65.75 127.7,65.75 127.7,71.29 127,71.29 127,73.29 124,73.29 124,93 | 121,50.67 120,50.67 | 108,50.67 109,50.67 | 108,58.21 109,58.21 | 108,65.75 109,65.75 | v46,42 46,44 | v55,42 55,44 55.08,44 | v64,42 64,44.99 | 79.24,40 79.24,38 v79,38 | 52,62.15 54,62.15 | 42,62.15 v42,60 | 53,62.15 v53,60
  Bottom 0.406: 101,47 v101,50 102,50 | v100,47 101,47 | 92,39 101,39 101,47 | 92,39 v92,40 | v87,40 87,39 | 87,39 92,39 | 87,39 87,38 86.75,38 v79,38 | 102,50 102,57 v100,57 | v91,66 91,69 84,69 | 84,69 v84,68 | 84,69 80,69 80,66 v81,66 | 62,60 v64,60 | v41,87 41,88 | v52,87 52,88 | v58,87 58,88 | v45,87 45,88 | 102,50 102.19,49.92 105.85,49.92 107.6,48.17 v108,48 122,48 128,42 131,42 | 128,23 128,24 131,27 | 17,23 9,31 9,32 | 48,42 42,48 | 76,38 72,42 | 42,52 50,60 | 67,84 63,88
  Bottom 0.813: 121,23 128,23 v128,25 | 121,23 108,23 | 108,23 17,23 | 131,42 131,27 | v108,25 108,23 | v121,25 121,23 | 9,32 9,49.5 12,49.5 v12,50 | 42,48 42,52 | 41,88 45,88 52,88 58,88 63,88 | 67,69 67,84 | 67,69 v67,66 | 80,69 67,69 | 48,42 v55,42 v64,42 72,42 72,46.87 | 76,38 v79,38 80.96,38 80.96,37.76 85.35,37.76 85.35,38 86.75,38 | 50,60 v53,60 62,60
  other vias: 128,47
+5V  (via drill 0.35, 0.8, 0.85)  (6 unrouted)
  Top 0.406: U$1.19 86.24,40 v86,40 | U$1.131 72,50.58 v72,51 | U$1.111 72,60.52 v72,60 | C1.1 18,82.58 17,82.58 17,83 | C27.2 128,43.45 | 109,43.45 C29.1 | C28.2 120,43.45 | C23.1 45,47.53 | C20.1 45,52.07 | 44,52.07 44,52 | C22.2 57,47.53 57,47 | C19.2 57,52.07 57,52 | C21.2 63,47.53 | 65,47 65,47.53 | C18.2 63,52.07 | 96,33.56 C58.2 | C59.1 84,33.56 v84,33 | v66,59 66,57 | v83,70 v83,67 82.24,67 U$1.98 | v82,38.8 82.23,38.57 v82.23,34.83 | U$1.74 94.17,66 v93,66 | 13,82 U3.2 | U4.1 12,69.09 | 14,69.09 v14,69 | 75,77 87,89 | 75,74 72,71
  Top 0.813: 44,52.07 44,47.53 | 57,52.07 57,47 57,40 | 65,52.07 65,47.53 63,47.53 | v66,36 66,40 | 66,40 66,47 65,47 | 57,40 66,40 | 57,40 44,40 44,47.53 | 66,57 66,52.07 65,52.07 | 44,52.07 39.93,52.07 v37,55 | 72,60.52 72,71 | 75,77 75,74 v77,74 | 13,82 v14,82 14,82.58 18,82.58 | U3.4 5.1,77 | 5.1,77 5,77 | 5.1,77 v14,77 | 12,69.09 14,69.09 | P1.1 88,96.99 88,89 87,89 | v107,41 107,43.45 109,43.45 | 120,43.45 121,43.45 v121,41 | 128,43.45 129,43.45 v129,41 | v98,31 98,33.56 96,33.56 | 44,47.53 45,47.53 | 45,52.07 44,52.07 | 63,52.07 65,52.07
  Bottom 0.406: 14,66 14,66.15 | 13,83.39 13,83 | 84,31 v84,33 83.91,33.16 v82.23,34.83 | v72,51 72,59 | 72,59 v72,60 | 72,59 v66,59 | v93,66 93,74 | v83,70 83,74 | v82,38.8 82.23,38.57 84.59,38.57 85.96,39.94 v86,40 | 14,83.39 23.2,74.19 24,74.19 | 24,74.19 25.84,74.19 26.04,74 27,74 | 24,74.19 24,58 27,55 | v66,36 79,36 84,31 | 84,31 84.49,31 84.67,30.82 85.28,30.82 85.45,31 v98,31 108,41 109,41
  Bottom 0.813: 13,83.39 14,83.39 | v37,55 27,55 | 93,74 83,74 v77,74 | 109,41 v121,41 v129,41
+5V1  (via drill 0.35)
  Top 0.152: 26.38,74.08 C15.1
  Top 0.406: C15.1 25,74.04 v25,74
+12V  (1 unrouted)
  Top 0.813: U3.3 12.9,86.3 16,86.3 | 16,86.3 20.19,86.3 C16.1 | 16,86.3
A1  (via drill 0.35)
  Top 0.152: 75.37,49.54 U$1.133 75.37,49.62 v76.59,49.62 | 47.41,73.69 U2.6 47.33,73.69 47.33,72.55 47.56,72.32 v47.94,72.32
  Bottom 0.152: v76.59,49.62 76.97,50 76.97,54.42 75.98,55.41 75.98,56.7 72.63,60.05 72.63,60.28 72.25,60.66 64.7,60.66 53.35,72.02 53.35,72.48 53.05,72.78 48.4,72.78 v47.94,72.32
A2  (via drill 0.35)
  Top 0.152: 75.3,49.16 U$1.134 75.3,49.08 v72.32,49.08 | 49.92,73.69 U2.8 49.92,73.62 49.92,72.55 v50.3,72.17 | v64.02,59.06 63.26,59.83 v63.26,60.74
  Bottom 0.152: v72.32,49.08 71.33,48.09 69.05,48.09 66.99,50.15 66.99,56.63 64.55,59.06 v64.02,59.06 | v63.26,60.74 63.26,61.2 52.89,71.56 50.91,71.56 v50.3,72.17
A3  (via drill 0.35)
  Top 0.152: 75.37,46.64 U$1.139 75.3,46.57 72.48,46.57 72.25,46.34 71.71,46.34 v69.35,48.7 | 51.22,73.69 U2.9 51.14,73.69 51.14,72.55 v51.52,72.17
  Bottom 0.152: v69.35,48.7 68.89,48.7 67.29,50.3 67.29,56.78 64.63,59.45 64.63,60.28 53.05,71.87 51.83,71.87 v51.52,72.17
A4
  Top 0.152: 75.3,45.65 U$1.141 75.37,45.58 76.97,45.58 77.28,45.27 77.28,44.43 76.36,43.52 68.13,43.52 67.29,44.36 67.29,46.95 66.99,47.25 66.99,49.62 67.29,49.92 67.29,61.5 67.67,61.88 67.67,65.39 67.9,65.62 67.9,69.2 66.91,70.19 66.91,70.65 66.23,71.33 66.08,71.33 64.09,73.31 64.09,74.53 60.82,77.81 56.02,77.81 55.71,78.11 54.65,78.11 54.49,78.27 54.03,78.27 53.88,78.42 52.13,78.42 48.62,74.91 U2.7
A5  (via drill 0.35)
  Top 0.152: 75.37,45.12 U$1.142 75.45,45.12 76.51,45.12 v76.67,44.97 | v45.42,72.32 45.04,72.32 44.81,72.55 U2.4
  Bottom 0.152: v76.67,44.97 77.28,45.58 77.28,54.57 76.29,55.56 76.29,56.85 72.93,60.21 72.93,60.44 72.4,60.97 64.86,60.97 53.65,72.17 53.65,72.63 53.2,73.08 46.19,73.08 v45.42,72.32
D2  (via drill 0.35)
  Top 0.152: 97.09,49.16 U$1.47 97.09,49.23 97.09,49.46 U$1.48 | 97.09,49.54 U$1.48 | 97.7,49.54 97.16,49.54 U$1.48 | 116.14,91.98 115.76,91.98 U1.22 116.14,91.98 | v103.03,49.01 102.73,48.7 101.43,48.7 100.52,49.62 97.16,49.62 U$1.48 | v105.01,49.16 104.71,49.46 104.71,69.89 117.28,82.46 117.28,85.12 117.59,85.43 117.59,90.53 117.28,90.84 117.28,91.6 116.9,91.98 116.14,91.98
  Bottom 0.152: v103.03,49.01 103.49,49.46 104.71,49.46 v105.01,49.16
D3  (via drill 0.35)
  Top 0.152: 116.14,98.31 115.76,98.31 U1.27 115.76,98.38 116.9,98.38 117.28,98 117.28,92.06 117.59,91.75 117.59,90.99 117.89,90.69 117.89,85.28 117.59,84.97 117.59,82.31 105.01,69.73 105.01,55.03 v105.32,54.72 | 97.09,52.13 U$1.53 97.16,52.13 97.77,52.13 98.46,52.82 102.19,52.82 v102.8,52.21
  Bottom 0.152: v105.32,54.72 v102.8,52.21
D4  (via drill 0.35)
  Top 0.152: 104.25,88.1 104.63,88.1 U1.10 104.71,88.17 105.85,88.17 v106.92,87.11 | 97.09,52.66 U$1.54 97.09,52.59 97.77,52.59 98.31,53.12 v102.8,53.12
  Bottom 0.152: v102.8,53.12 102.5,53.43 102.5,81.31 106.61,85.43 106.61,86.8 v106.92,87.11
D5  (via drill 0.35)
  Top 0.152: 103.79,89.39 104.63,89.39 U1.9 104.71,89.39 v106.31,89.39 | 97.09,53.12 U$1.55 97.01,53.12 96.33,53.12 v95.79,53.65
  Bottom 0.152: v95.79,53.65 102.19,60.05 102.19,81.47 106.31,85.58 v106.31,89.39
D6  (via drill 0.35)
  Top 0.152: 103.64,90.61 104.63,90.61 U1.8 104.71,90.69 v106.31,90.69 | 97.09,54.11 U$1.57 97.01,54.11 96.33,54.11 v95.79,54.65
  Bottom 0.152: v95.79,54.65 96.1,54.95 96.63,54.95 101.89,60.21 101.89,81.62 106,85.73 106,88.78 105.7,89.09 105.7,90.08 v106.31,90.69
D7  (via drill 0.35)
  Top 0.152: 97.01,54.65 U$1.58 97.09,54.57 v98.31,54.57 | 104.63,91.91 U1.7 104.71,91.98 105.85,91.98 v106.23,91.6
  Bottom 0.152: v98.31,54.57 97.16,54.57 96.4,53.81 96.4,53.35 96.1,53.05 95.49,53.05 95.18,53.35 95.18,54.95 95.49,55.25 96.48,55.25 101.58,60.36 101.58,81.77 105.7,85.89 105.7,88.63 105.39,88.94 105.39,90.23 105.7,90.53 105.7,91.07 v106.23,91.6
D8  (via drill 0.35)
  Top 0.152: 97.09,55.1 U$1.59 97.01,55.1 96.33,55.1 95.79,55.63 v95.79,56.47 | 104.63,93.2 U1.6 104.56,93.2 103.49,93.2 103.26,92.97 v103.26,92.59
  Bottom 0.152: v95.79,56.47 96.1,56.78 96.63,56.78 100.67,60.82 100.67,82.23 104.78,86.34 104.78,88.17 104.48,88.48 104.48,91.37 v103.26,92.59
D9  (via drill 0.35)
  Top 0.152: 97.09,60.66 U$1.70 97.09,60.59 v98.61,60.59 | 104.63,94.42 U1.5 104.63,94.5 103.49,94.5 102.65,93.66 102.65,92.29 102.96,91.98 v102.96,91.07
  Bottom 0.152: v98.61,60.59 99.07,60.59 99.75,61.27 99.75,82.69 103.87,86.8 103.87,87.72 103.56,88.02 103.56,90.92 103.41,91.07 v102.96,91.07
D10  (via drill 0.35)
  Top 0.152: 105.47,95.72 104.71,95.72 U1.4 104.63,95.79 103.49,95.79 103.26,95.56 v102.96,95.56 | 91.68,63.48 U$1.79 91.68,63.56 91.68,64.25 92.52,65.08 v92.97,65.08
  Bottom 0.152: v92.97,65.08 98.16,70.27 98.16,89.62 102.12,93.58 102.12,95.18 102.5,95.56 v102.96,95.56
D11  (via drill 0.35)
  Top 0.152: 104.25,97.01 104.63,97.01 U1.3 104.25,97.01 | 91.22,63.48 U$1.80 91.14,63.48 91.14,64.17 91.98,65.01 91.98,65.85 92.9,66.76 v93.73,66.76 | v103.03,96.56 103.49,97.01 104.25,97.01
  Bottom 0.152: v93.73,66.76 94.19,66.76 97.85,70.42 97.85,89.77 101.81,93.73 101.81,95.34 v103.03,96.56
D12  (via drill 0.35)
  Top 0.152: 114.92,95.79 115.68,95.79 U1.25 114.92,95.79 | 90.69,63.48 U$1.81 90.69,63.56 90.69,64.17 91.68,65.16 91.68,66 92.75,67.06 93.13,67.06 v93.73,67.67 | v112.02,98.31 114.54,95.79 114.92,95.79
  Bottom 0.152: v93.73,67.67 94.65,67.67 97.55,70.57 97.55,89.92 101.51,93.89 101.51,95.49 102.42,96.4 102.42,97.85 102.88,98.31 v112.02,98.31
D13  (via drill 0.35)
  Top 0.152: 115.38,94.5 115.68,94.5 U1.24 115.68,94.57 114.54,94.57 114.23,94.88 114.23,95.64 112.18,97.7 111.72,97.7 109.13,100.29 103.18,100.29 101.74,98.84 101.74,92.75 v102.04,92.44 | 87.72,63.48 U$1.87 87.64,63.41 v87.64,61.58
  Bottom 0.152: v87.64,61.58 87.94,61.88 91.53,61.88 93.89,59.52 98.46,59.52 100.06,61.12 100.06,82.53 104.17,86.65 104.17,87.87 103.87,88.17 103.87,91.07 103.26,91.68 102.8,91.68 v102.04,92.44
D14  (via drill 0.35)
  Top 0.152: 115.38,90.69 115.68,90.69 U1.21 115.76,90.76 116.9,90.76 117.28,90.38 117.28,85.58 116.82,85.12 114.69,85.12 114.46,85.35 111.57,85.35 110.19,83.98 105.93,83.98 105.7,83.75 103.72,83.75 103.49,83.53 99.83,83.53 99.53,83.22 99.53,80.32 v92.21,73.01 | 87.18,63.41 U$1.88 87.18,63.48 87.18,64.17 v88.33,65.31
  Bottom 0.152: v88.33,65.31 91.22,65.31 92.52,66.61 92.52,72.7 v92.21,73.01
D16  (via drill 0.35)
  Top 0.152: 104.25,98.23 104.63,98.23 U1.2 103.49,98.31 102.12,96.94 102.12,95.26 v102.73,94.65 | 85.73,63.48 U$1.91 85.66,63.41 v85.66,59.75
  Bottom 0.152: v85.66,59.75 85.66,59.29 88.78,56.17 94.57,56.17 95.49,57.08 96.48,57.08 100.36,60.97 100.36,82.38 104.48,86.5 104.48,88.02 104.17,88.33 104.17,91.22 103.41,91.98 102.96,91.98 102.65,92.29 102.65,94.57 v102.73,94.65
D17  (via drill 0.35)
  Top 0.152: 116.14,97.01 115.76,97.01 U1.26 115.68,97.09 114.54,97.09 114.46,97.01 113.78,97.01 112.63,98.16 112.63,98.61 112.33,98.92 110.96,98.92 109.28,100.59 103.03,100.59 101.43,98.99 101.43,90.08 99.07,87.72 98.61,87.72 98,87.11 98,85.89 98.61,85.28 98.61,85.05 97.7,84.13 97.7,81.24 92.21,75.75 91.3,75.75 90.38,74.84 87.33,74.84 85.35,72.86 80.86,72.86 77.89,69.89 77.89,68.36 v77.58,68.06 | 84.74,63.41 U$1.93 84.74,63.33 84.74,62.42 83.91,61.58 78.8,61.58 v78.19,62.19
  Bottom 0.152: v78.19,62.19 78.19,67.45 v77.58,68.06
D18  (via drill 0.35)
  Top 0.152: 104.25,99.53 104.63,99.53 U1.1 104.63,99.6 103.49,99.6 103.11,99.22 v103.11,98.99 | 83.22,63.41 U$1.96 83.22,63.48 83.22,64.63 84.06,65.47 85.2,65.47 85.35,65.62 85.35,69.5 v85.05,69.81 | v87.18,71.94 87.49,71.64 95.03,71.64 v96.94,73.54
  Bottom 0.152: v87.18,71.94 v85.05,69.81 | v96.94,73.54 97.24,73.85 97.24,90.08 101.2,94.04 101.2,95.64 102.12,96.56 102.12,98 v103.11,98.99
D19
  Top 0.152: 104.25,86.8 104.63,86.8 U1.11 103.49,86.88 103.41,86.8 102.04,86.8 99.98,84.74 99.22,84.74 98.31,83.83 98.31,80.93 91.91,74.53 87.49,74.53 85.51,72.55 81.01,72.55 78.19,69.73 78.19,67.14 80.7,64.63 80.7,63.48 U$1.101 80.78,63.48
D21  (via drill 0.35)
  Top 0.152: 105.01,84.36 104.71,84.36 U1.13 105.01,84.36 | 80.25,63.48 U$1.102 80.25,63.56 80.25,64.09 v79.56,64.78 | v79.11,67.14 78.5,67.75 78.5,69.58 81.16,72.25 85.66,72.25 87.64,74.23 92.06,74.23 98.61,80.78 98.61,83.68 99.37,84.44 100.59,84.44 v100.9,84.74 | v103.18,87.49 103.34,87.33 103.49,87.33 103.56,87.41 105.7,87.41 106.69,86.42 108.97,86.42 109.28,86.72 109.89,86.72 110.19,86.42 110.19,84.44 110.04,84.29 105.93,84.29 105.85,84.36 105.01,84.36
  Bottom 0.152: v79.56,64.78 79.56,66.68 v79.11,67.14 | v100.9,84.74 101.36,84.74 103.18,86.57 v103.18,87.49
D22  (via drill 0.35)
  Top 0.152: 79.79,63.48 U$1.103 79.72,63.41 79.72,62.27 80.1,61.88 82,61.88 v82.31,62.19 | 115.68,83.07 U1.15 115.68,83.14 114.54,83.14 114.23,82.84 v114.23,82.61
  Bottom 0.152: 114.08,81.39 114.23,81.39 v114.23,82.61 114.23,85.43 107.45,92.21 106.99,92.21 106.69,92.52 105.78,92.52 105.32,92.06 105.32,91.6 105.09,91.37 105.09,90.84 104.78,90.53 104.78,88.63 105.09,88.33 105.09,86.19 100.97,82.08 100.97,60.66 96.17,55.86 95.18,55.86 95.11,55.79 88.71,55.79 v82.31,62.19
D23  (via drill 0.35)
  Top 0.152: 79.26,63.48 U$1.104 79.26,63.41 79.26,62.34 v79.11,62.19 | 115.76,84.44 U1.16 115.68,84.36 114.54,84.36 114.16,84.74 v113.62,84.74 | v79.11,68.06 81.09,70.04 81.09,71.26 81.47,71.64 85.96,71.64 87.94,73.62 92.36,73.62 99.22,80.48 99.22,83.37 99.68,83.83 102.5,83.83 103.56,84.9 105.7,84.9 105.93,84.67 106,84.67 106.08,84.59 109.28,84.59 v109.58,84.9
  Bottom 0.152: v79.11,62.19 78.5,62.8 78.5,67.45 v79.11,68.06 | v109.58,84.9 113.47,84.9 v113.62,84.74
D24  (via drill 0.35)
  Top 0.152: 78.72,63.48 U$1.105 78.72,63.56 78.72,66.15 77.43,67.45 77.28,67.45 76.67,68.06 76.67,69.35 v77.28,69.96 | 115.76,85.66 U1.17 115.68,85.66 113.09,85.66 v112.78,85.96 | v79.79,69.96 79.79,70.42 81.31,71.94 85.81,71.94 87.79,73.92 92.21,73.92 98.92,80.63 98.92,83.53 99.53,84.13 102.35,84.13 103.11,84.9 103.11,85.66 103.64,86.19 105.62,86.19 105.7,86.11 v109.58,86.11
  Bottom 0.152: v77.28,69.96 77.58,69.66 79.49,69.66 v79.79,69.96 | v109.58,86.11 110.42,85.28 112.1,85.28 v112.78,85.96
D25  (via drill 0.35)
  Top 0.152: 115.38,86.88 115.68,86.88 U1.18 115.68,86.95 111.34,86.95 111.26,87.03 110.42,87.03 109.74,87.72 109.74,88.55 108.21,90.08 106.08,90.08 105.93,89.92 105.7,89.92 105.62,90 103.64,90 103.26,89.62 101.43,89.62 99.22,87.41 98.77,87.41 98.31,86.95 98.31,86.04 98.92,85.43 98.92,84.9 98,83.98 98,81.09 92.06,75.14 v91.6,75.14 | 75.37,61.58 U$1.109 75.37,61.66 75.37,66.99 76.13,67.75 76.13,68.21 76.36,68.44 76.36,71.64 80.17,75.45 81.92,75.45 v82.23,75.14
  Bottom 0.152: v82.23,75.14 82.69,74.69 91.14,74.69 v91.6,75.14
D26  (via drill 0.35)
  Top 0.152: 86.19,63.48 U$1.90 86.19,63.41 86.19,60.13 86.27,60.05 v86.27,57.31 | 115.68,88.17 U1.19 115.61,88.17 114.54,88.17 113.62,87.26 111.49,87.26 v111.11,87.64
  Bottom 0.152: v86.27,57.31 86.72,57.31 88.55,55.48 95.26,55.48 95.34,55.56 96.33,55.56 101.28,60.51 101.28,81.92 105.39,86.04 105.39,88.48 105.09,88.78 105.09,90.38 105.39,90.69 105.39,91.22 105.62,91.45 105.62,91.91 105.93,92.21 106.54,92.21 106.84,91.91 107.3,91.91 111.11,88.1 v111.11,87.64
GND  (via drill 0.35, 0.8, 0.85)  (9 unrouted)
  Top 0.406: 35.29,43 C11.1 | 35.29,41 C12.2 | C26.2 49,44.99 | 49,47.53 C23.2 | C20.2 49,52.07 52,52.07 C19.1 | C25.1 52,44.99 | C22.1 52,47.53 | C24.1 59,44.99 | C18.1 59,52.07 | C21.1 60.36,47.53 60.36,47.56 59,47.56 59,47 | C44.2 113,65.75 115,65.75 117,65.75 C43.1 | 116,70.29 117,71.29 C40.1 | C47.2 113,58.21 115,58.21 117,58.21 C46.1 | C50.2 113,50.67 | 117,50.67 C49.1 | 15,26.4 R7.1 | 15,30.18 17.08,30.18 | 15,34.02 R4.1 | 15,37.83 R3.1 | 15,41.64 R2.1 | 15,45.45 R1.2 | 35.29,36 C13.2 | 35.29,50 C10.1 | 113,43.45 C29.2 | C28.1 117,43.45 | 113,37.91 C32.2 | C31.1 117,37.91 | C35.2 113,32.37 | C34.1 117,32.37 | C59.2 88.14,33.56 90,33.56 92,33.56 C58.1 | C38.2 113,26.83 | C37.1 117,26.83 | U1.14 100,83.06 100,78 | C36.1 124,26.83 | C33.1 124,32.37 | C30.1 124,37.91 | 124,43.45 C27.1 | 124,50.67 C48.1 | 123,58.21 C45.1 | C42.1 124,65.75 | C39.1 124,71.29 | 48,62.15 C52.1 | C53.2 47,62.15 | 61,62.15 C55.1 | C56.2 58,62.15 | C9.1 36,62.15 36,62 | 22,75.04 22,75 | U$1.143 73,44.6 73,44.1 | U$1.144 73,44.1 | 73,44.1 73,44 | 82.24,40 U$1.11 82.38,42.3 82.46,42.38 82.46,43.29 80.78,44.97 78.57,44.97 v76.67,46.87 | 82.24,40 82,40 | U$1.12 82.74,40 82.24,40 | U$1.38 100,44.6 100,44.1 U$1.37 | U$1.52 100,51.6 | 100,51.6 101,51.6 101,51 | U$1.72 100,61.6 100,62 | U$1.60 100,55.6 100,55 | U$1.132 72,50.1 | 72,50.1 72,50 | U$1.119 72,56.52 72,56 | 82,68 81.74,68 U$1.99 | U2.2 42.27,70 | U2.11 53.7,70 53,70 | U2.22 48.62,86 49,86 | U2.21 49.9,86 49,86 | U2.18 53.7,86 | 53.7,86 54,86 | U$1.56 101,53.6 101,55 | 72,50.1 68,50.1 68,50 | U$1.44 99,47.6 99,48 100,48 | U$1.50 100,50.6 100,51.6 | U$1.25 89.24,40 | 89.24,40 89.24,37 89,37 | U$1.26 89.74,40 89.24,40 | 80,17 80,21 | 21,66.5 C3.2 | C16.2 30,93.5 v30,93 | 49,86 49,90 | 53.7,86 53.7,90 54,90
  Top 0.406: 67.6,47.56 68,47.56 | U$1.94 84.24,65 85.22,65 | U$1.92 85.22,65 | U$1.89 86.67,65 | 85.22,65 86.67,65 | U$1.83 89.67,71 90,71 | 86.67,65 86.67,71 86,71 | U$1.73 94.67,64 98,64 98,61.63 | U3.1 13,79.7 | 12,72.91 U4.4 | J2.1 39.69,100 39,100 | 39.5,96.64 43.5,100.64 J2.4 | 47.31,100 J2.7 | 39,97 47.31,97 arc45 48.13,97.34 49.79,99 | J2.SH2 37.13,102 | J3.8 62.56,92 61,92 | 26.7,76.7 22,76.7 | C15.2 25.84,72.71 25.17,72.71 22,69.53 22,71 | 28,67 32.74,62.26 arc45 33,62.15 37.74,66.89 arc-45 38,67 | 49.79,99 56.2,99 arc-45 56.29,98.96 59.26,96 61.17,97.91 arc45 61.26,97.95 66.15,102.85 65.88,103.12 63.23,105.77 arc45 J3.11 | 47.31,99 46.87,99 | 39,98.08 arc45 38.96,98.17 37.13,100 | 49.79,99 arc45 49.87,99.2 J2.SH1 | 66,103 arc45 66.32,103.13 69.08,105.9 J3.10 | 79,98 80.45,99.45 arc-45 80.54,99.49 P1.4 | 49,57 47,59 | 47,62.15 42.26,66.89 arc45 42,67 | 47,62.15 51.74,66.89 arc-45 52,67 | 12,73 15.49,76.49 arc-45 16,76.7 | 59,62.15 arc-45 58.74,62.26 54,67 | 98,72 104,66 | 85,21 92,28 | 90,30 92,28 | 92,28 99,21 | 119,21 123,25 | 104,44 97,37 | 100,74 97,71 | 114.71,25.12 arc45 115,25
  Top 0.813: 17.08,26.45 R7.1 16.93,25.99 | 17.08,30.18 R5.1 17.08,30.57 | 17.08,33.99 R4.1 17.08,34.38 | 17.08,37.8 R3.1 17.08,38.19 | 17.08,41.62 R2.1 16.93,42 | 49,44.99 49,47.53 49,52.07 49,57 | 52,44.99 52,47.53 52,52.07 | 59,44.99 59,47 v59,48 59,52.07 59,62.15 | 116,70.29 112.27,70.29 C41.2 | 115,65.75 115,58.21 115,50.67 | 33,42 33,36 35.29,36 | 33,42 33,49 | 33,49 35.29,49 35.29,50 | 33,42 35.29,42 | 115,26.83 115,32.37 | 115,32.37 115,37.91 | 115,43.45 115,37.91 | 115,50.67 115,43.45 | 123,26.83 123,32.37 | 123,32.37 123,37.91 | 123,37.91 123,43.45 | 123,43.45 123,50.67 | 123,50.67 123,58.21 123,65.75 | 123,65.75 123,71.29 124,71.29 | 100,61.6 104,61.6 | 104,61.6 104,55 | 104,55 104,51 | 104,51 104,48 | 104,48 104,44 100,44 100,44.1 | 101,51 104,51 | 100,48 104,48 | 100,55 101,55 104,55 | 82.74,40 83,40 83,37 89,37 90,37 | 90,37 97,37 | 90,37 90,33.56 90,30 | 81.74,68 81.74,71 86,71 90,71 97,71 | 104,61.6 104,66 | 73,44.6 68,44.6 68,47.56 v68,48 68,50 68,56.52 72,56.52 | 115,21 v112,21 99,21 | 85,21 v84,21 80,21 61,21 | 61,21 v23,21 19,25 15,25 15,26.4 15,30.18 15,34.02 15,37.83 15,41.64 15,45.45 | 115,26.83 115,25 115,21 | 123,26.83 123,25 | 119,21 115,21 | 100,78 100,74 | 47,59 47,62.15 48,62.15 | 53,67 54,67 | 53,67 52,67 | 53,70 53,67 | 42.27,70 42,70 42,67 38,67 | 33,49 33,62.15 36,62.15 | v33,87 33,83 26.7,76.7 | 22,67 22,66.5 21,66.5 | C1.2 20,82.49 20,76.7 | 22,67 28,67 | 22,67 22,71 22,75.04 22,76.7 20,76.7 | v38,90 39,90 | 39,90 49,90 54,90 | 20,76.7 16,76.7 13,79.7 | 12,72.91 12,73 | 39,90 39,97 39,98 | 39,100 37.13,100 37.13,102 37,102 37,104 J2.SH2 | 47.31,97 47.31,99 47.31,100 | 49.87,102 J2.SH1 | 61,92 59.26,92 59.26,96 | P1.4 84,99.49 | 79,98 74.75,98 J3.15 61,97.95
  Top 0.813: 115,26.83 113,26.83 | 113,32.37 115,32.37 | 117,32.37 115,32.37 | 117,26.83 115,26.83 | 124,26.83 123,26.83 | 124,32.37 123,32.37 | 117,37.91 115,37.91 | 115,37.91 113,37.91 | 124,37.91 123,37.91 | 117,43.45 115,43.45 | 115,43.45 113,43.45 | 115,50.67 117,50.67 | 113,50.67 115,50.67 | 113,58.21 117,58.21 | 113,65.75 117,65.75 | 124,65.75 123,65.75 | 123,43.45 124,43.45 | 123,50.67 124,50.67 | 92,33.56 88.14,33.56 | 35.29,42 35.29,43 | 35.29,42 35.29,41 | 59,62.15 58,62.15 | 59,62.15 61,62.15 | v61,17 61,21
  Bottom 0.406: 83.3,13.7 J6.G | J7.G 111.68,17 | v30,93 30,90 | 60.36,47.56 61,47.56 67.6,47.56 67.75,47.63 68,47.63 71.56,47.63 71.71,47.79 75.75,47.79 v76.67,46.87 | 26,11 23,14 | 17,100.9 17,100 27,90
  Bottom 0.813: 27,90 30,90 33,90 | 33,90 v38,90 | 33,90 v33,87 | v68,48 68,47.63 | v59,48 60.36,48 60.36,47.56 | 61,47.56 68,47.56 v68,48 | v68,48 68.31,47.69 68.31,47.46 70.96,47.46 | 17,100.9 J1.3 18.92,103.9 J1.2 | J4.G 30.16,11 26,11 | 23,14 v23,21 | J7.G 111.68,21 v112,21 | J6.G 83.93,21 v84,21 | J5.G 56.91,17 v61,17
GND1
  Top 0.813: 115,69.75 115,62.21
N$1  (via drill 0.35)
  Top 0.152: 45.27,25.16 C5.2 | 45.35,25.08 C5.2 | 41.16,26.07 31.71,26.07 28.96,28.81 28.96,30.34 25.77,33.54 25.77,33.99 24.85,34.91 22.87,34.91 21.88,35.9 21.88,39.56 21.57,39.86 21.57,43.22 20.51,44.28 20.51,45.42 R1.1 | 41.16,26.07 44.74,26.07 45.35,25.46 45.73,25.46 45.96,25.23 45.96,25.16 45.35,25.16 C5.2 | v98.84,24.01 v100.82,22.03 | v80.55,24.01 80.55,23.55 79.56,22.57 48.02,22.57 46.8,23.78 46.8,25.31 46.03,26.07 45.65,26.07 42.38,29.35 42.38,30.26 42.07,30.57 41.46,30.57 41.16,30.26 41.16,26.07
  Bottom 0.152: v100.82,22.03 109.13,13.72 J7.S | v98.84,24.01 98.54,24.32 80.86,24.32 v80.55,24.01
N$2  (via drill 0.35)
  Top 0.152: 79.79,42.22 U$1.6 79.72,42.15 79.72,41.01 79.79,40.93 v81.47,40.93 | 85.2,42.22 U$1.17 85.28,42.15 85.28,41.01 v85.2,40.93 | 92.67,42.22 U$1.32 92.75,42.22 92.75,44.97 | 97.01,61.05 U$1.71 97.01,61.12 95.87,61.12 92.75,58 92.75,44.97 | 92.75,44.97 v92.67,44.97
  Bottom 0.152: v81.47,40.93 81.77,41.23 84.9,41.23 v85.2,40.93 85.2,41.01 85.43,41.23 85.51,41.23 87.41,43.14 87.41,43.6 89.09,45.27 92.36,45.27 v92.67,44.97
N$3  (via drill 0.35)
  Top 0.152: 38.64,25.16 C6.1 38.57,25.16 35.75,25.16 | 20.51,41.62 R2.2 20.51,41.54 20.51,40.47 21.57,39.41 21.57,35.75 22.72,34.6 24.7,34.6 25.46,33.84 25.46,33.38 28.66,30.18 28.66,28.66 31.56,25.77 35.14,25.77 35.75,25.16 | 35.75,25.16 v32.62,22.03
  Bottom 0.152: 27.66,13.65 J4.S 27.67,13.72 27.67,17.08 v32.62,22.03
N$4
  Top 0.152: 32.93,25.08 C7.1 | 32.85,25.16 C7.1 | C7.1 32.77,25.16 31.71,25.16 28.36,28.51 28.36,30.03 25.16,33.23 25.16,33.69 24.55,34.3 22.57,34.3 20.89,35.98 20.51,35.98 20.51,37.8 R3.2 20.51,37.88 20.51,39.02 19.36,40.17 19.36,45.58 18.14,46.8 12.43,46.8 11.36,45.73 11.36,20.74 11.74,20.36 14.18,20.36 18.14,16.39 30.26,16.39 34.22,20.36 51.87,20.36 J5.S
N$5  (via drill 0.35)
  Top 0.152: 28.05,25.16 C8.1 | 20.51,33.99 R4.2 20.51,33.92 20.51,32.85 21.57,31.79 21.57,30.64 26.98,25.23 | 28.13,25.08 C8.1 | 26.98,25.23 27.06,25.16 27.98,25.16 C8.1 | v26.45,22.03 26.45,24.7 26.98,25.23
  Bottom 0.152: v26.45,22.03 26.45,12.58 26.53,12.51 28.74,12.51 28.81,12.58 28.81,14.79 27.98,15.63 27.98,16.93 32.47,21.42 32.93,21.42 33.84,22.34 68.74,22.34 69.03,22.05 J6.S
N$6  (1 unrouted)
  Top 0.152: 75.3,59.06 U$1.114 75.3,58.99 74.53,58.99 74.38,58.84 73.24,58.84 72.7,59.37 71.71,59.37 71.33,59.75 71.33,65.69 68.82,68.21 68.82,69.66 67.83,70.65 67.83,71.1 66.46,72.48 66.3,72.48 65.01,73.77 65.01,74.99 61.27,78.72 56.47,78.72 56.17,79.03 55.1,79.03 54.95,79.18 54.49,79.18 54.34,79.33 49.54,79.33 49.39,79.18 43.67,79.18 43.52,79.33 43.06,79.33 42.91,79.49 38.41,79.49 38.34,79.56 38.34,81.85 38.41,81.92 38.41,86.19 35.06,89.54 35.06,92.29 35.29,92.52 35.29,94.04 31.18,98.16 31.18,105.47 32.09,106.39 39.62,106.39 41,105 41,102
N$7  (via drill 0.35)
  Top 0.152: 39.56,25.16 C6.2 39.63,25.16 v40.7,25.16 | 94.19,42.15 U$1.35 94.27,42.15 94.27,41.01 v91.53,38.26 | v47.71,24.32 47.71,23.78 48.32,23.17 79.26,23.17 79.64,23.55 79.64,24.47 80.1,24.93 81.47,24.93 82.76,26.22 82.76,33.54 82.92,33.69 82.92,34.07 83.75,34.91 85.05,34.91 85.73,35.59 v86.65,35.59
  Bottom 0.152: v40.7,25.16 41.54,24.32 44.89,24.32 45.5,24.93 47.1,24.93 v47.71,24.32 | v86.65,35.59 86.65,36.05 87.79,37.2 89.39,37.2 89.85,37.65 90.92,37.65 v91.53,38.26
N$8  (via drill 0.35)
  Top 0.152: 33.69,25.16 C7.2 33.77,25.16 v34.83,25.16 | 90.23,42.15 U$1.27 90.23,42.07 90.23,39.86 90,39.63 v90,38.26 | v45.81,24.32 45.81,23.86 47.71,21.95 79.87,21.95 84.36,26.45 84.36,31.86 v85.28,32.77
  Bottom 0.152: v34.83,25.16 35.98,24.01 45.5,24.01 v45.81,24.32 | v85.28,32.77 84.97,33.08 84.97,34.83 87.64,37.5 89.24,37.5 v90,38.26
N$9  (via drill 0.35)
  Top 0.152: 28.89,25.16 C8.2 28.96,25.16 v30.03,25.16 | 75.3,58 U$1.116 75.37,58 76.06,58 v76.59,57.46 | v76.29,42.91 v65.01,31.63
  Bottom 0.152: v30.03,25.16 31.48,23.71 57.08,23.71 v65.01,31.63 | v76.29,42.91 76.29,43.37 77.58,44.66 77.58,54.72 76.59,55.71 v76.59,57.46
N$10  (via drill 0.35)
  Top 0.152: 44.59,25.08 C5.1 44.51,25.16 43.82,25.16 43.82,25.08 44.2,24.7 44.51,24.7 47.56,21.65 80.02,21.65 84.67,26.3 84.67,31.25 v84.97,31.56 | 87.18,42.15 U$1.21 87.26,42.15 87.26,41.01 87.79,40.47 v87.79,38.11
  Bottom 0.152: v84.97,31.56 84.44,32.09 84.44,32.55 84.67,32.77 84.67,34.98 v87.79,38.11
N$11
  Top 0.152: 75.3,58.53 U$1.115 75.22,58.53 73.08,58.53 72.55,59.06 71.56,59.06 71.03,59.6 71.03,65.54 68.51,68.06 68.51,69.5 67.52,70.49 67.52,70.95 66.38,72.09 66.23,72.09 64.7,73.62 64.7,74.84 61.12,78.42 56.32,78.42 56.02,78.72 54.95,78.72 54.8,78.88 54.34,78.88 54.19,79.03 49.69,79.03 49.54,78.88 43.52,78.88 43.37,79.03 42.91,79.03 42.76,79.18 38.26,79.18 38.03,79.41 38.03,82 38.11,82.08 38.11,86.04 34.76,89.39 34.76,92.44 34.98,92.67 34.98,93.89 30.87,98 30.87,105.62 31.94,106.69 32,106.69 32.09,106.69 39.74,106.69 41.64,104.79 41.64,102.23 J2.3
N$12
  Top 0.152: 75.37,57.54 U$1.117 75.3,57.54 74.61,57.54 73.92,58.23 72.93,58.23 72.4,58.76 69.89,58.76 69.05,59.6 69.05,61.43 69.58,61.96 69.58,65.54 69.73,65.69 69.73,66.38 68.21,67.9 68.21,69.35 67.22,70.34 67.22,70.8 66.3,71.71 66.15,71.71 64.4,73.47 64.4,74.69 60.97,78.11 56.17,78.11 55.86,78.42 54.8,78.42 54.65,78.57 54.19,78.57 54.03,78.72 49.84,78.72 49.69,78.57 43.37,78.57 43.22,78.72 42.76,78.72 42.6,78.88 38.11,78.88 37.73,79.26 37.73,82.15 37.8,82.23 37.8,85.89 34.45,89.24 34.45,92.59 34.68,92.82 34.68,93.73 30.57,97.85 30.57,105.78 31.79,106.99 31.94,106.99 31.94,107 40,107 44.77,102.23 J2.5
N$13  (via drill 0.35)
  Top 0.152: 75.3,57.08 U$1.118 75.3,57.01 72.48,57.01 72.25,57.24 70.95,57.24 68.74,59.45 v68.74,63.03 | v62.87,86.42 61.58,86.42 v58.99,89.01 | v57,92 56,93 v56,96 | v46,106 46.04,105.96 J2.6
  Bottom 0.152: v68.74,63.03 66.08,65.69 66.08,68.67 66.3,68.89 66.3,82.99 v62.87,86.42 | v58.99,89.01 58.99,90.01 v57,92 | v56,96 56,106 v46,106
N$14
  Top 0.152: U2.16 56.24,81.7 56.4,81.54 63.33,81.54 70.88,89.09 70.88,91.42 J3.2
N$15  (via drill 0.35)
  Top 0.152: 55.03,82.92 U2.17 54.95,82.92 v54.95,89.01
  Bottom 0.152: 54.95,91.45 54.95,91 | 54.95,91 v54.95,89.01 | J3.1 70.78,94.65 69.13,96.31 60.25,96.31 54.95,91
N$16  (via drill 0.35)
  Top 0.152: v56.24,76.29 U2.13 | v61.88,89.01 v61.88,87.03
  Bottom 0.152: v56.24,76.29 56.7,76.29 61.88,81.47 v61.88,87.03 | v61.88,89.01 61.88,91.47 61.63,91.73 61.63,95.63 62,96 69,96 69,94.74 J3.3
N$17  (via drill 0.35)
  Top 0.152: 55.03,73.39 55.03,73.69 U2.12 54.95,73.77 54.95,74.91 v55.63,75.6 | v64.63,83.75 65.08,83.75 68.82,87.49 v68.82,87.94
  Bottom 0.152: v55.63,75.6 56.47,75.6 v64.63,83.75 | 68.44,87.94 v68.82,87.94 65.1,91.66 J3.6
N$18  (via drill 0.35)
  Top 0.152: 38.8,62.19 C9.2 38.8,62.11 v39.79,62.11 | v40.4,72.25 40.7,72.25 41.01,72.55 U2.1
  Bottom 0.152: v39.79,62.11 40.4,62.72 v40.4,72.25
N$19  (via drill 0.35)  (2 unrouted)
  Top 0.152: 97.01,45.58 U$1.40 96.94,45.58 v93.35,45.58 | v34.07,39.25 C12.1 | v74,41.54 74,41.08 67.98,35.06 59.06,35.06 v59,35 57,33
  Bottom 0.152: v93.35,45.58 88.94,45.58 87.11,43.75 87.11,43.29 85.35,41.54 v74,41.54 | v34.07,39.25 35.32,38 59,38 v59,35
N$20  (via drill 0.35)  (1 unrouted)
  Top 0.152: 35.29,44.89 C11.2 35.29,44.81 36.36,44.81 36.59,44.59 36.59,33.54 35.82,32.77 34.68,32.77 32.32,35.14 32.32,45.88 32.28,45.92 | 46.03,82.92 U2.24 46.11,82.92 v46.11,79.79 | 32.28,45.92 31.4,46.8 30.26,46.8 30,46.53 30,36 26,36 26,38 | v32.01,55.94 32.32,55.63 32.32,45.96 32.28,45.92
  Bottom 0.152: v46.11,79.79 45.81,79.49 45.81,76.29 41.01,71.48 41.01,58.23 38.72,55.94 v32.01,55.94
N$21  (via drill 0.35)  (1 unrouted)
  Top 0.152: 35.29,51.6 C10.2 35.29,51.67 v34.07,51.67 | 46.8,74.69 47.06,74.95 | 47.06,74.95 47.33,75.22 | v31.71,49.31 31.56,49.31 31.4,49.16 30.26,49.16 30,49.42 30,53 26,53 26,52 | 47.06,74.95 46.95,75.07 v46.72,75.07 | v47.33,79.79 47.33,82.92 U2.23
  Bottom 0.152: v31.71,49.31 v34.07,51.67 33.84,51.37 34.6,51.37 41.31,58.07 41.31,71.33 43.67,73.69 45.35,73.69 v46.72,75.07 46.64,75.07 46.11,75.6 46.11,78.57 v47.33,79.79
N$22  (via drill 0.35)  (1 unrouted)
  Top 0.152: 35.14,33.46 35.29,33.46 C13.1 35.14,33.46 | 97.01,46.57 U$1.42 97.09,46.57 97.77,46.57 99.3,45.04 v101.74,45.04 | 35.14,33.46 34.45,33.46 33.84,34.07 v33.84,34.53 | v87.11,34.3 84.06,34.3 83.53,33.77 83.53,33.38 83.37,33.23 83.37,25.92 79.72,22.26 47.86,22.26 46.49,23.63 46.49,25.16 45.88,25.77 45.5,25.77 v41.77,29.5 | v39,33 43,33
  Bottom 0.152: v101.74,45.04 101.51,44.81 101.51,38.87 101.2,38.57 93.96,38.57 92.75,37.35 91.53,37.35 91.22,37.04 90.15,37.04 89.7,36.59 88.1,36.59 87.56,36.05 87.56,35.14 87.11,34.68 v87.11,34.3 | v41.77,29.5 38.87,29.5 38.69,29.68 | v33.84,34.53 38.69,29.68 | 38.69,29.68 38.69,32.69 v39,33
N$23  (via drill 0.35)
  Top 0.152: 20.51,30.26 R5.2 20.51,30.34 v20.51,31.94 | 57.46,73.69 U2.14 57.54,73.69 57.54,72.55 57.31,72.32 v56.93,72.32 | v40.4,56.24 40.4,64.47 v41.92,66
  Bottom 0.152: v20.51,31.94 20.51,37.2 32.32,49.01 32.32,49.46 33.92,51.06 34.76,51.06 39.94,56.24 v40.4,56.24 | v41.92,66 41.62,66.3 41.62,71.18 43.82,73.39 53.35,73.39 54.42,72.32 v56.93,72.32
N$24  (via drill 0.35)
  Top 0.152: 91.22,42.15 U$1.29 91.22,42.07 91.22,38.87 90.92,38.57 90.92,37.96 91.22,37.65 92.14,37.65 v92.44,37.96 | 20.51,26.45 R7.2 20.51,26.38 20.51,25.77 v21.73,25.77 | v85.96,34.91 85.66,34.6 83.91,34.6 83.22,33.92 83.22,33.54 83.07,33.38 83.07,26.07 81.62,24.62 80.25,24.62 79.94,24.32 79.94,23.4 79.41,22.87 48.17,22.87 47.1,23.94 47.1,25.23 v47.41,25.54
  Bottom 0.152: v92.44,37.96 92.14,37.96 91.83,37.65 91.37,37.65 91.07,37.35 90,37.35 89.54,36.89 87.94,36.89 87.26,36.2 87.26,35.29 86.88,34.91 v85.96,34.91 | v47.41,25.54 47.1,25.23 45.35,25.23 44.74,24.62 41.69,24.62 41.31,25 41.31,25.46 41.01,25.77 v21.73,25.77
N$25  (via drill 0.35)
  Top 0.152: 43.6,73.77 U2.3 43.52,73.77 v43.52,75.37 | v40.32,90.99 40.62,90.69 67.69,90.69 68,91 68,91.75 J3.4 66.37,93.38 J3.5
  Bottom 0.152: v43.52,75.37 43.98,75.37 45.2,76.59 45.2,81.92 40.32,86.8 v40.32,90.99
N$26  (via drill 0.35)
  Top 0.152: 92.59,63.48 U$1.77 92.67,63.41 92.67,62.72 v92.14,62.19 | 20.51,49.31 R6.2 20.51,49.39 20.51,50.45 v26.6,56.55
  Bottom 0.152: v92.14,62.19 83.22,62.19 82.61,62.8 80.63,62.8 79.11,61.27 65.01,61.27 57.54,68.74 57.54,72.63 49.69,80.48 45.88,80.48 45.5,80.1 45.5,76.44 40.7,71.64 40.7,58.38 38.57,56.24 32.62,56.24 32.32,56.55 v26.6,56.55
N$27  (via drill 0.35)
  Top 0.152: 97.09,46.11 U$1.41 97.01,46.11 95.87,46.11 93.05,48.93 93.05,57.84 95.34,60.13 v95.79,60.13 | v96.63,76.51 v98.77,74.38 | v89,92 86,92 P1.3
  Bottom 0.152: v95.79,60.13 99.45,63.79 99.45,73.69 v98.77,74.38 | v96.63,76.51 96.94,76.82 96.94,92 v89,92
N$28  (via drill 0.35)
  Top 0.152: 77.28,42.22 U$1.1 77.28,42.3 v77.28,43.44 | v77.2,60.66 77.2,61.88 75.68,63.41 75.68,66.38 v75.98,66.68 | v75.52,68.06 76.06,68.59 76.06,71.79 80.02,75.75 83.3,75.75 83.83,76.29 83.83,80.48 87.11,83.75 87.11,86 v87,86
  Bottom 0.152: v77.28,43.44 77.28,43.9 77.89,44.51 77.89,54.87 76.89,55.86 76.89,56.85 77.2,57.16 v77.2,60.66 | v75.98,66.68 75.98,67.6 v75.52,68.06 | v87,86 87,94 88,94 P1.2
N$29  (via drill 0.35)
  Top 0.152: U2.26 43.55,88.55 v44,89 | v55,104 58,107 73,107 73.62,106.38 J3.9
  Bottom 0.152: v44,89 55,100 v55,104
N$30  (via drill 0.35)
  Top 0.152: U2.27 42.27,88.28 v43,89 | v54,101 58.9,105.9 J3.12
  Bottom 0.152: v43,89 54,100 v54,101